# EAGLE design power_dist (EAGLE 9.6.0)
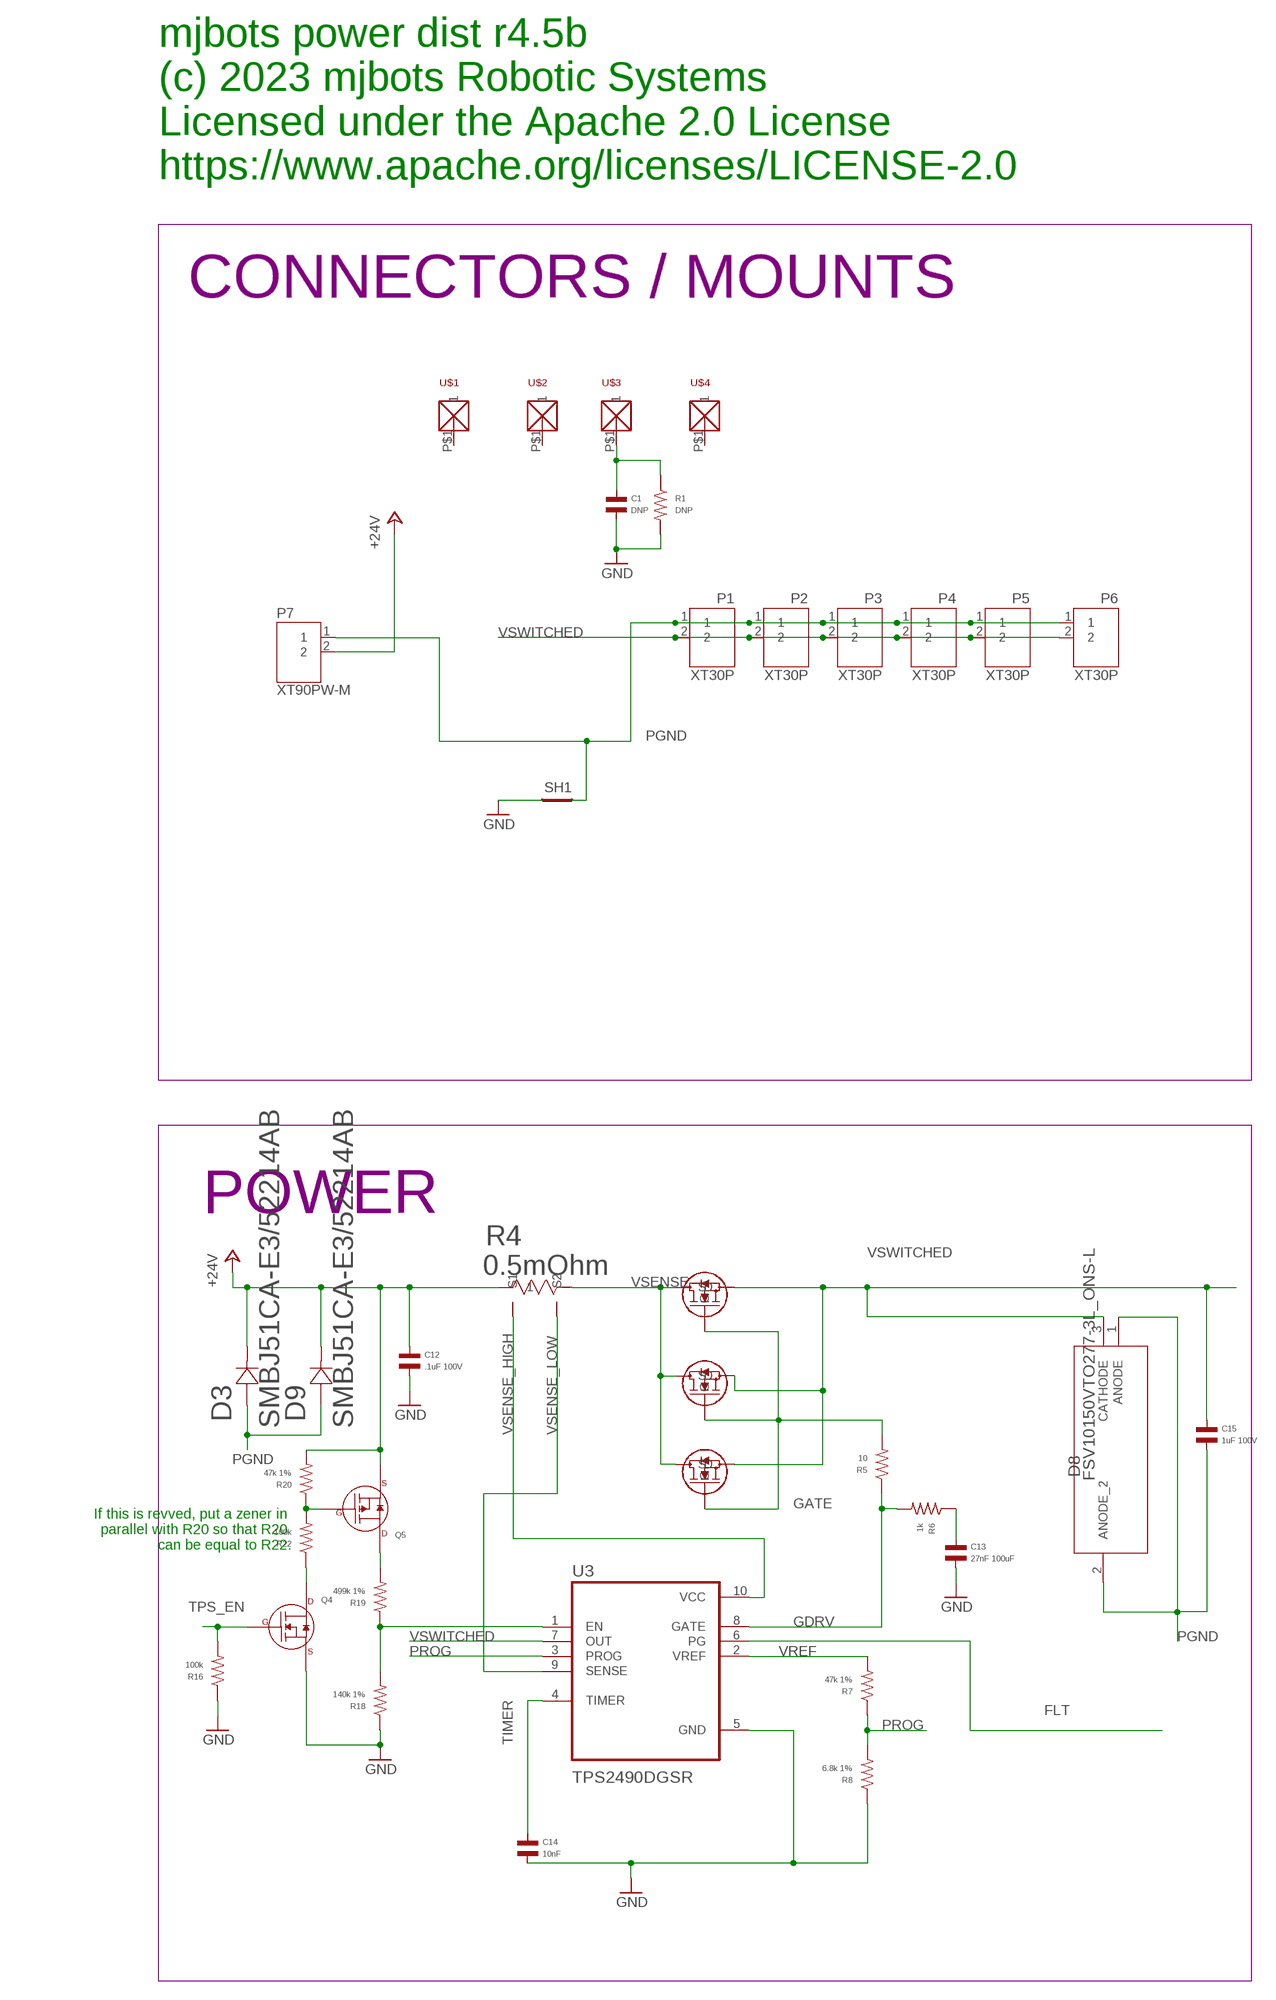
[diagram p0: schematic, sheet 1, part 1 of 2]
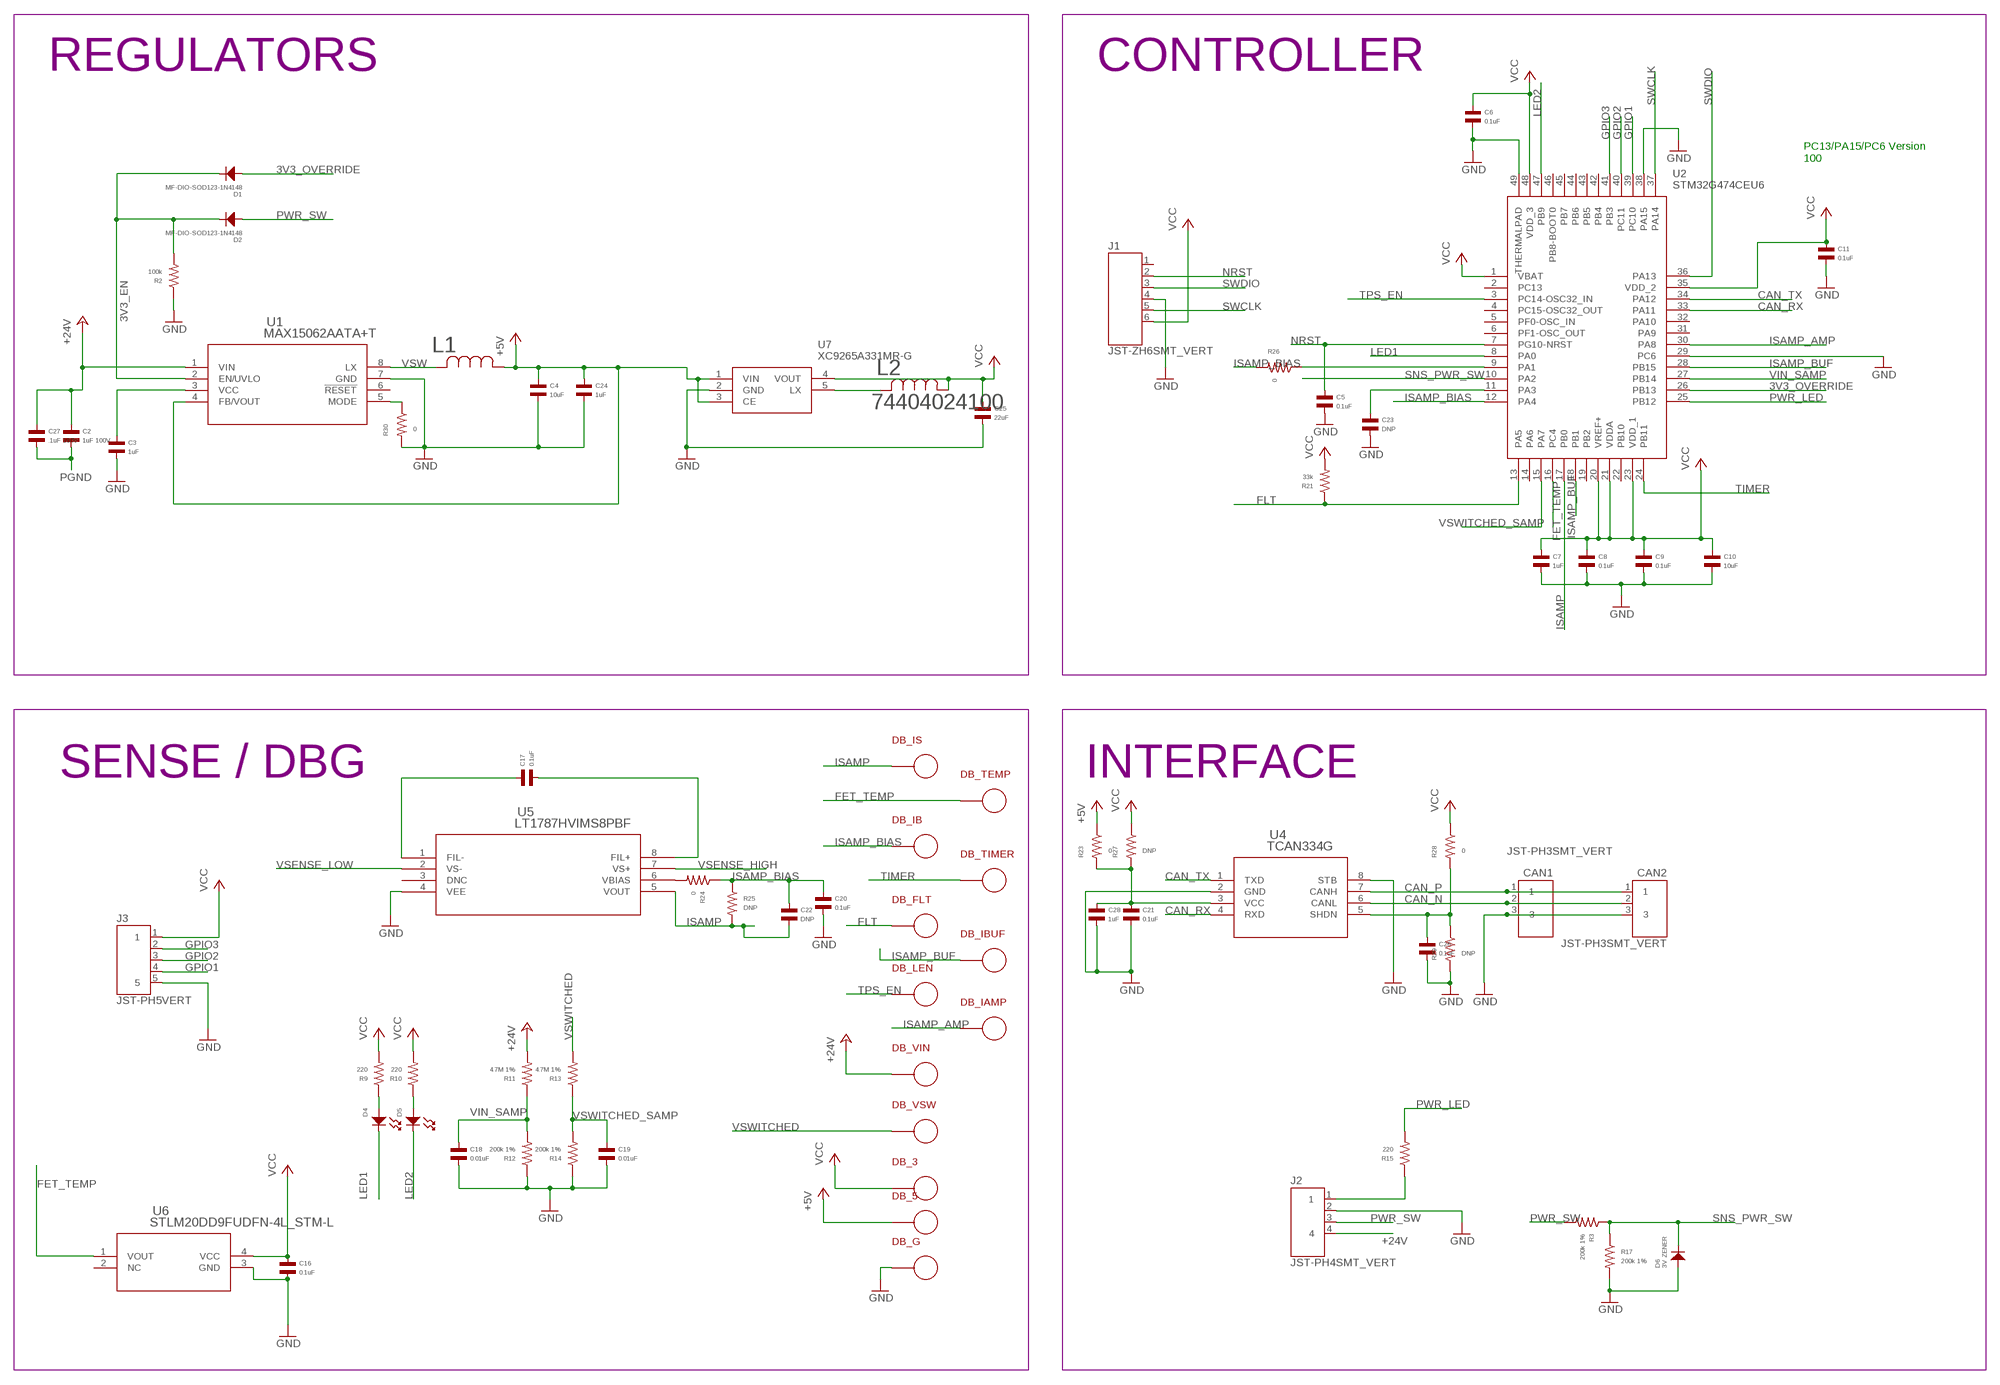
[diagram p1: schematic, sheet 1, part 2 of 2]

## Parts
C1  DNP  CAPACITOR_NP_0603  [C0603]
C2  1uF 100V  CAPACITOR_NP_0805  [C0805]
C3  1uF  CAPACITOR_NP_0603  [C0603]
C4  10uF  CAPACITOR_NP_1206  [C1206]
C5  0.1uF  CAPACITOR_NP_0603  [C0603]
C6  0.1uF  CAPACITOR_NP_0603  [C0603]
C7  1uF  CAPACITOR_NP_0603  [C0603]
C8  0.1uF  CAPACITOR_NP_0603  [C0603]
C9  0.1uF  CAPACITOR_NP_0603  [C0603]
C10  10uF  CAPACITOR_NP_1206  [C1206]
C11  0.1uF  CAPACITOR_NP_0603  [C0603]
C12  .1uF 100V  CAPACITOR_NP_0603  [C0603]
C13  27nF 100uF  CAPACITOR_NP_0603  [C0603]
C14  10nF  CAPACITOR_NP_0603  [C0603]
C15  1uF 100V  CAPACITOR_NP_0805  [C0805]
C16  0.1uF  CAPACITOR_NP_0603  [C0603]
C17  0.1uF  CAPACITOR_NP_0603  [C0603]
C18  0.01uF  CAPACITOR_NP_0603  [C0603]
C19  0.01uF  CAPACITOR_NP_0603  [C0603]
C20  0.1uF  CAPACITOR_NP_0603  [C0603]
C21  0.1uF  CAPACITOR_NP_0603  [C0603]
C22  DNP  CAPACITOR_NP_0603  [C0603]
C23  DNP  CAPACITOR_NP_0603  [C0603]
C24  1uF  CAPACITOR_NP_0402  [C0402]
C25  22uF  CAPACITOR_NP_1206  [C1206]
C26  0.1uF  CAPACITOR_NP_0603  [C0603]
C27  .1uF 100V  CAPACITOR_NP_0603  [C0603]
C28  1uF  CAPACITOR_NP_0603  [C0603]
CAN1  JST-PH3SMT_VERT  [JST_B3B_PH-SM4-TB(LF)(SN)]
CAN2  JST-PH3SMT_VERT  [JST_B3B_PH-SM4-TB(LF)(SN)]
D1  MF-DIO-SOD123-1N4148  DIODES_1N4148_SOD-123  [SOD-123]
D2  MF-DIO-SOD123-1N4148  DIODES_1N4148_SOD-123  [SOD-123]
D3  SMBJ51CA-E3/52214AB  [DIODE_DO-214AB]
D4  LED_SINGLE-0603  [LED0603]
D5  LED_SINGLE-0603  [LED0603]
D6  3V ZENER  DIODES_1N4148_SOD-123  [SOD-123]
D8  FSV10150VTO277-3L_ONS-L  [TO277-3L_ONS-L]
D9  SMBJ51CA-E3/52214AB  [DIODE_DO-214AB]
DB_3  PAD24AWG_PAD  [24AWG_PAD]
DB_5  PAD24AWG_PAD  [24AWG_PAD]
DB_FLT  PAD24AWG_PAD  [24AWG_PAD]
DB_G  PAD24AWG_PAD  [24AWG_PAD]
DB_IAMP  PAD24AWG_PAD  [24AWG_PAD]
DB_IB  PAD24AWG_PAD  [24AWG_PAD]
DB_IBUF  PAD24AWG_PAD  [24AWG_PAD]
DB_IS  PAD24AWG_PAD  [24AWG_PAD]
DB_LEN  PAD24AWG_PAD  [24AWG_PAD]
DB_TEMP  PAD24AWG_PAD  [24AWG_PAD]
DB_TIMER  PAD24AWG_PAD  [24AWG_PAD]
DB_VIN  PAD24AWG_PAD  [24AWG_PAD]
DB_VSW  PAD24AWG_PAD  [24AWG_PAD]
J1  JST-ZH6SMT_VERT  [JST_B6B-ZR-SM4-TF(LF)(SN)]
J2  JST-PH4SMT_VERT  [JST_B4B_PH-SM4-TB(LF)(SN)]
J3  JST-PH5VERT  [JST_B5B_PH-SM4-TB(LF)(SN)]
L1  SRN4018-220M  [IND_BOURNS_SRN4018]
L2  74404024100  [IND_4024100_WRE]
P1  XT30P  [XT30P]
P2  XT30P  [XT30P]
P3  XT30P  [XT30P]
P4  XT30P  [XT30P]
P5  XT30P  [XT30P]
P6  XT30P  [XT30P]
P7  XT90PW-M  [XT90PW-M]
Q1  PSMN4R8-100BSEJ  [D2PAK_SOT404_NEX]
Q2  PSMN4R8-100BSEJ  [D2PAK_SOT404_NEX]
Q3  PSMN4R8-100BSEJ  [D2PAK_SOT404_NEX]
Q4  N-CHANNEL_FET_SOT-23-3  [SOT-23-3]
Q5  P-CHANNEL_FET_SOT-23-3  [SOT-23-3]
R1  DNP  RESISTOR_0603  [R0603]
R2  100k  RESISTOR_0603  [R0603]
R3  200k 1%  RESISTOR_0603  [R0603]
R4  0.5mOhm  SENSE_RESISTOR2512  [SHUNT2512]
R5  10  RESISTOR_0603  [R0603]
R6  1k  RESISTOR_0603  [R0603]
R7  47k 1%  RESISTOR_0603  [R0603]
R8  6.8k 1%  RESISTOR_0603  [R0603]
R9  220  RESISTOR_0603  [R0603]
R10  220  RESISTOR_0603  [R0603]
R11  4.7M 1%  RESISTOR_0603  [R0603]
R12  200k 1%  RESISTOR_0603  [R0603]
R13  4.7M 1%  RESISTOR_0603  [R0603]
R14  200k 1%  RESISTOR_0603  [R0603]
R15  220  RESISTOR_0603  [R0603]
R16  100k  RESISTOR_0603  [R0603]
R17  200k 1%  RESISTOR_0603  [R0603]
R18  140k 1%  RESISTOR_0603  [R0603]
R19  499k 1%  RESISTOR_0603  [R0603]
R20  47k 1%  RESISTOR_0603  [R0603]
R21  33k  RESISTOR_0603  [R0603]
R22  100k  RESISTOR_0603  [R0603]
R23  0  RESISTOR_0603  [R0603]
R24  0  RESISTOR_0603  [R0603]
R25  DNP  RESISTOR_0603  [R0603]
R26  0  RESISTOR_0603  [R0603]
R27  DNP  RESISTOR_0603  [R0603]
R28  0  RESISTOR_0603  [R0603]
R29  DNP  RESISTOR_0603  [R0603]
R30  0  RESISTOR_0603  [R0603]
SH1  SHORTMEDIUM  [SHORT_TOP-MEDIUM]
U1  MAX15062AATA+T  [21-0487A_MXM]
U2  STM32G474CEU6  [QFN50P700X700X60-49N]
U3  TPS2490DGSR  [SOP50P490X110-10N]
U4  TCAN334G  [SOIC8]
U5  LT1787HVIMS8PBF  [MSOP-8_MS]
U6  STLM20DD9FUDFN-4L_STM-L  [UDFN-4L_STM-L]
U7  XC9265A331MR-G  [SOT95P280X130-5N]
U$1  MOUNT  [M2.5MOUNT]
U$2  MOUNT  [M2.5MOUNT]
U$3  MOUNT  [M2.5MOUNT]
U$4  MOUNT  [M2.5MOUNT]

## Nets
3V3_EN: D1.CATHODE D2.CATHODE R2.P$2 U1.2(EN/UVLO)
3V3_OVERRIDE: D1.ANODE U2.26(PB13)
+5V: C4.P$1 C24.P$1 DB_5.P$1 L1.1 R23.P$1 U1.4(FB/VOUT) U7.1(VIN) U7.3(CE)
+24V: C2.P$1 C12.P$1 C27.P$1 D3.P$1 D9.P$1 DB_VIN.P$1 J2.4 P7.2 Q5.P$2(SOURCE) R4.1 R11.P$2 R20.P$2 U1.1(VIN)
CAN_N: CAN1.2 CAN2.2 U4.6(CANL)
CAN_P: CAN1.1 CAN2.1 U4.7(CANH)
CAN_RX: U2.33(PA11) U4.4(RXD)
CAN_TX: U2.34(PA12) U4.1(TXD)
FET_TEMP: DB_TEMP.P$1 U2.16(PC4) U6.1(VOUT)
FLT: DB_FLT.P$1 R21.P$1 U2.13(PA5) U3.6(PG)
GATE: Q1.1(G) Q2.1(G) Q3.1(G) R5.P$2
GDRV: R5.P$1 R6.P$2 U3.8(GATE)
GND: C1.P$2 C3.P$2 C4.P$2 C5.P$2 C6.P$2 C7.P$2 C8.P$2 C9.P$2 C10.P$2 C11.P$2 C12.P$2 C13.P$2 C14.P$2 C16.P$2 C18.P$2 C19.P$2 C20.P$2 C21.P$2 C23.P$2 C24.P$2 C25.P$2 C26.P$2 C28.P$2 CAN1.3 CAN2.3 D6.ANODE DB_G.P$1 J1.4 J2.2 J3.5 Q4.P$2(SOURCE) R1.P$2 R2.P$1 R8.P$1 R12.P$1 R14.P$1 R16.P$1 R17.P$2 R18.P$1 R29.P$2 R30.P$2 SH1.1 U1.7(GND) U2.29(PC6) U2.38(PA15) U2.49(THERMALPAD) U3.5(GND) U4.2(GND) U4.8(STB) U5.4(VEE) U6.3(GND) U7.2(GND)
GPIO1: J3.4 U2.39(PC10)
GPIO2: J3.3 U2.40(PC11)
GPIO3: J3.2 U2.41(PB3)
ISAMP: C22.P$2 DB_IS.P$1 R25.P$2 U2.17(PB0) U5.5(VOUT)
ISAMP_AMP: DB_IAMP.P$1 U2.30(PA8)
ISAMP_BIAS: C20.P$1 C22.P$1 DB_IB.P$1 R24.P$1 R25.P$1 R26.P$2 U2.12(PA4)
ISAMP_BUF: DB_IBUF.P$1 U2.18(PB1) U2.28(PB15)
LED1: D4.CATHODE U2.8(PA0)
LED2: D5.CATHODE U2.47(PB9)
N$1: R30.P$1 U1.5(MODE)
N$2: J2.1 R15.P$1
N$3: R24.P$2 U5.6(VBIAS)
N$4: C3.P$1 U1.3(VCC)
N$5: C23.P$1 U2.11(PA3)
N$6: C17.P$1 U5.1(FIL-)
N$7: C17.P$2 U5.8(FIL+)
N$8: D4.ANODE R9.P$1
N$9: C13.P$1 R6.P$1
N$10: R26.P$1 U2.9(PA1)
N$11: Q5.P$3(DRAIN) R19.P$2
N$12: R18.P$2 R19.P$1 U3.1(EN)
N$13: Q4.P$3(DRAIN) R22.P$1
N$14: D5.ANODE R10.P$1
N$15: C1.P$1 R1.P$1 U$3.P$1
N$16: Q5.P$1(GATE) R20.P$1 R22.P$2
N$17 [power]: C21.P$1 C28.P$1 R23.P$2 R27.P$2 U4.3(VCC)
N$18: L2.2 U7.5(LX)
N$19: C26.P$1 R28.P$2 R29.P$1 U4.5(SHDN)
NRST: C5.P$1 J1.2 U2.7(PG10-NRST)
PGND: C2.P$2 C15.P$2 C27.P$2 D3.P$2 D8.1(ANODE) D8.2(ANODE_2) D9.P$2 P1.1 P2.1 P3.1 P4.1 P5.1 P6.1 P7.1 SH1.2
PROG: R7.P$1 R8.P$2 U3.3(PROG)
PWR_LED: R15.P$2 U2.25(PB12)
PWR_SW: D2.ANODE J2.3 R3.P$2
SNS_PWR_SW: D6.CATHODE R3.P$1 R17.P$1 U2.10(PA2)
SWCLK: J1.5 U2.37(PA14)
SWDIO: J1.3 U2.36(PA13)
TIMER: C14.P$1 DB_TIMER.P$1 U2.24(PB11) U3.4(TIMER)
TPS_EN: DB_LEN.P$1 Q4.P$1(GATE) R16.P$2 U2.3(PC14-OSC32_IN)
VCC [power]: C6.P$1 C7.P$1 C8.P$1 C9.P$1 C10.P$1 C11.P$1 C16.P$1 C25.P$1 DB_3.P$1 J1.6 J3.1 L2.1 R9.P$2 R10.P$2 R21.P$2 R27.P$1 R28.P$1 U2.1(VBAT) U2.20(VREF+) U2.21(VDDA) U2.23(VDD_1) U2.35(VDD_2) U2.48(VDD_3) U6.4(VCC) U7.4(VOUT)
VIN_SAMP: C18.P$1 R11.P$1 R12.P$2 U2.27(PB14)
VREF: R7.P$2 U3.2(VREF)
VSENSE: Q1.2(D) Q2.2(D) Q3.2(D) R4.2
VSENSE_HIGH: R4.3(S1) U3.10(VCC) U5.7(VS+)
VSENSE_LOW: R4.4(S2) U3.9(SENSE) U5.2(VS-)
VSW: L1.2 U1.8(LX)
VSWITCHED: C15.P$1 D8.3(CATHODE) DB_VSW.P$1 P1.2 P2.2 P3.2 P4.2 P5.2 P6.2 Q1.3(S) Q2.3(S) Q3.3(S) R13.P$2 U3.7(OUT)
VSWITCHED_SAMP: C19.P$1 R13.P$1 R14.P$2 U2.15(PA7)
Unconnected: J1.1 U1.6(!RESET) U2.2(PC13) U2.4(PC15-OSC32_OUT) U2.5(PF0-OSC_IN) U2.6(PF1-OSC_OUT) U2.14(PA6) U2.19(PB2) U2.22(PB10) U2.31(PA9) U2.32(PA10) U2.42(PB4) U2.43(PB5) U2.44(PB6) U2.45(PB7) U2.46(PB8-BOOT0) U5.3(DNC) U6.2(NC) U$1.P$1 U$2.P$1 U$4.P$1

## Notes on the sheet
- mjbots power dist r4.5b
  (c) 2023 mjbots Robotic Systems
  Licensed under the Apache 2.0 License
  https://www.apache.org/licenses/LICENSE-2.0
- CONNECTORS / MOUNTS | REGULATORS | CONTROLLER
- PC13/PA15/PC6 Version
  100
- POWER | SENSE / DBG | INTERFACE
- If this is revved, put a zener in 
  parallel with R20 so that R20 
  can be equal to R22.

## Library data of the parts
C1 = mfpassives:CAPACITOR_NP: Library: MF_Passives Description: Device for Non-Polarized Capacitors. Manufacture part number (MPN) can be added via Attributes. Check https://factory.macrofab.com/parts for the house parts list.; POPULATE: 0
C2 C15 = mfpassives:CAPACITOR_NP: Library: MF_Passives Description: Device for Non-Polarized Capacitors. Manufacture part number (MPN) can be added via Attributes. Check https://factory.macrofab.com/parts for the house parts list.; MF: MURATA; MPN: GCM21BC72A105KE36L; POPULATE: 1
C3 C7 C28 = mfpassives:CAPACITOR_NP: Library: MF_Passives Description: Device for Non-Polarized Capacitors. Manufacture part number (MPN) can be added via Attributes. Check https://factory.macrofab.com/parts for the house parts list.; HOUSEPART: 1; MPN: MF-CAP-0603-1uF; POPULATE: 1
C4 C10 = mfpassives:CAPACITOR_NP: Library: MF_Passives Description: Device for Non-Polarized Capacitors. Manufacture part number (MPN) can be added via Attributes. Check https://factory.macrofab.com/parts for the house parts list.; HOUSEPART: 1; MPN: MF-CAP-1206-10uF; POPULATE: 1
C5 C6 C8 C9 C11 C16 C17 C20 C21 C26 = mfpassives:CAPACITOR_NP: Library: MF_Passives Description: Device for Non-Polarized Capacitors. Manufacture part number (MPN) can be added via Attributes. Check https://factory.macrofab.com/parts for the house parts list.; HOUSEPART: 1; MPN: MF-CAP-0603-0.1uF; POPULATE: 1
C12 C27 = mfpassives:CAPACITOR_NP: Library: MF_Passives Description: Device for Non-Polarized Capacitors. Manufacture part number (MPN) can be added via Attributes. Check https://factory.macrofab.com/parts for the house parts list.; HOUSEPART: 0; MPN: GRM188R72A104KA35D; POPULATE: 1
C13 = mfpassives:CAPACITOR_NP: Library: MF_Passives Description: Device for Non-Polarized Capacitors. Manufacture part number (MPN) can be added via Attributes. Check https://factory.macrofab.com/parts for the house parts list.; HOUSEPART: 0; MPN: C0603C273K1RAC7867; POPULATE: 1
C14 C18 C19 = mfpassives:CAPACITOR_NP: Library: MF_Passives Description: Device for Non-Polarized Capacitors. Manufacture part number (MPN) can be added via Attributes. Check https://factory.macrofab.com/parts for the house parts list.; HOUSEPART: 1; MPN: MF-CAP-0603-0.01uF; POPULATE: 1
C22 C23 = mfpassives:CAPACITOR_NP: Library: MF_Passives Description: Device for Non-Polarized Capacitors. Manufacture part number (MPN) can be added via Attributes. Check https://factory.macrofab.com/parts for the house parts list.; HOUSEPART: 1; POPULATE: 0
C24 = mfpassives:CAPACITOR_NP: Library: MF_Passives Description: Device for Non-Polarized Capacitors. Manufacture part number (MPN) can be added via Attributes. Check https://factory.macrofab.com/parts for the house parts list.; HOUSEPART: 1; MPN: MF-CAP-0402-1uF; POPULATE: 1
C25 = mfpassives:CAPACITOR_NP: Library: MF_Passives Description: Device for Non-Polarized Capacitors. Manufacture part number (MPN) can be added via Attributes. Check https://factory.macrofab.com/parts for the house parts list.; MF: Samsung; MPN: CL31B226KPHNNNE; POPULATE: 1
CAN1 CAN2 = precharge:JST-PH3; MF: JST; MPN: B3B-PH-SM4-TB(LF)(SN); POPULATE: 1
D1 D2 = mfdiscretesemi:DIODES: Library: MF_Discrete_Semiconductor Description: Device for Single Packaged Diodes.; HOUSEPART: YES; MPN: MF-DIO-SOD123-1N4148; POPULATE: 1; URL: https://factory.macrofab.com/part/MF-DIO-SOD123-1N4148
D3 D9 = power_dist:SMBJ51CA-E3/52; MPN: SMC5K51A-M3/I; POPULATE: 1
D4 D5 = mfleds:LED_SINGLE: Library: MF_LEDs Description: Device for Single LED Packages. Manufacture part number (MFG#) can be added via Attributes.; HOUSEPART: 1; MPN: MF-LED-0603-RED; POPULATE: 1
D6 = mfdiscretesemi:DIODES: Library: MF_Discrete_Semiconductor Description: Device for Single Packaged Diodes.; MPN: MMSZ4682T1G; POPULATE: 1; VALUE: MF-DIO-SOD123-1N4148
D8 = power_dist:FSV10150V; BUILT_BY: EMA_Jessica; COPYRIGHT: Copyright (C) 2018 Accelerated Designs. All rights reserved; MANUFACTURER_PART_NUMBER: FSV10150V; MPN: FSV10150V; POPULATE: 1; SOURCELIBRARY: ON_Semiconductor_2019-12-30; VENDOR: ON Semiconductor
DB_3 DB_5 DB_FLT DB_G DB_IAMP DB_IB DB_IBUF DB_IS DB_LEN DB_TEMP DB_TIMER DB_VIN DB_VSW = precharge:PAD; POPULATE: 0
J1 = precharge:JST-ZH6; MF: JST; MPN: B6B-ZR-SM4-TF(LF)(SN); POPULATE: 1
J2 = precharge:JST-PH4; MF: JST; MPN: B4B-PH-SM4-TB(LF)(SN); POPULATE: 1
J3 = power_dist:JST-PH5; MF: JST; MPN: B5B-PH-SM4-TB(LF)(SN); POPULATE: 1
L1 = controller:SRN4018-220M; MANUFACTURER_PART_NUMBER: 74404042470; MF: Wurth Electronics; MPN: 74404042470; POPULATE: 1; VENDOR: Wurth
L2 = moteus_hp:74404024100; COPYRIGHT: Copyright (C) 2022 Ultra Librarian. All rights reserved.; DIGI-KEY_PART_NUMBER_1: 732-5428-2-ND; DIGI-KEY_PART_NUMBER_2: 732-5428-1-ND; DIGI-KEY_PART_NUMBER_3: 732-5428-6-ND; MANUFACTURER_PART_NUMBER: 74404024100; MF: Wurth Electronics; MFR_NAME: Wurth Electronics; MPN: 74404024100; POPULATE: 1
P1-P6 = precharge:XT30; MF: AMASS; MPN: XT30UPB-F; POPULATE: 1
P7 = power_dist:XT90; POPULATE: 1
Q1-Q3 = power_dist:PSMN4R8-100BSEJ; BUILT_BY: EMA_Cory; COPYRIGHT: Copyright (C) 2018 Accelerated Designs. All rights reserved; DATASHEET: https://assets.nexperia.com/documents/data-sheet/PSMN4R8-100BSE.pdf; MANUFACTURER_PART_NUMBER: PSMN3R7-100BSE; MPN: PSMN3R7-100BSE; POPULATE: 1; SOURCELIBRARY: Nexperia_2020-02-27; VENDOR: Nexperia
Q4 = mfdiscretesemi:N-CHANNEL_FET: Library: MF_Discrete_Semiconductor Description: Device for Single N-Channel Mosfet. Manufacture part number (MFG#) can be added via Attributes.; HOUSEPART: NO; MPN: BSS123; POPULATE: 1
Q5 = mfdiscretesemi:P-CHANNEL_FET: Library: MF_Discrete_Semiconductor Description: Device for Single P-Channel Mosfet. Manufacture part number (MFG#) can be added via Attributes.; HOUSEPART: NO; MPN: ZXMP10A13FTA; POPULATE: 1
R1 = mfpassives:RESISTOR: Library: MF_Passives Description: Device for Resistors. Manufacture part number (MPN), Voltage, Tolerance, and Wattage Rating can be added via Attributes. Check https://factory.macrofab.com/parts for the house parts list.; POPULATE: 0
R2 R16 R22 = mfpassives:RESISTOR: Library: MF_Passives Description: Device for Resistors. Manufacture part number (MPN), Voltage, Tolerance, and Wattage Rating can be added via Attributes. Check https://factory.macrofab.com/parts for the house parts list.; HOUSEPART: 1; MPN: MF-RES-0603-100K; POPULATE: 1
R3 R12 R14 R17 = mfpassives:RESISTOR: Library: MF_Passives Description: Device for Resistors. Manufacture part number (MPN), Voltage, Tolerance, and Wattage Rating can be added via Attributes. Check https://factory.macrofab.com/parts for the house parts list.; HOUSEPART: 0; MPN: RC0603FR-07200KL; POPULATE: 1
R4 = power_dist:SENSE_RESISTOR; MF: VISHAY DALE; MPN: WSLF2512L5000FEA; POPULATE: 1
R5 = mfpassives:RESISTOR: Library: MF_Passives Description: Device for Resistors. Manufacture part number (MPN), Voltage, Tolerance, and Wattage Rating can be added via Attributes. Check https://factory.macrofab.com/parts for the house parts list.; HOUSEPART: 1; MPN: MF-RES-0603-10; POPULATE: 1
R6 = mfpassives:RESISTOR: Library: MF_Passives Description: Device for Resistors. Manufacture part number (MPN), Voltage, Tolerance, and Wattage Rating can be added via Attributes. Check https://factory.macrofab.com/parts for the house parts list.; HOUSEPART: 1; MPN: MF-RES-0603-1K; POPULATE: 1
R7 R20 = mfpassives:RESISTOR: Library: MF_Passives Description: Device for Resistors. Manufacture part number (MPN), Voltage, Tolerance, and Wattage Rating can be added via Attributes. Check https://factory.macrofab.com/parts for the house parts list.; HOUSEPART: 0; MPN: RC0603FR-0747KL; POPULATE: 1
R8 = mfpassives:RESISTOR: Library: MF_Passives Description: Device for Resistors. Manufacture part number (MPN), Voltage, Tolerance, and Wattage Rating can be added via Attributes. Check https://factory.macrofab.com/parts for the house parts list.; HOUSEPART: 0; MPN: RC0603FR-076K8L; POPULATE: 1
R9 R10 R15 = mfpassives:RESISTOR: Library: MF_Passives Description: Device for Resistors. Manufacture part number (MPN), Voltage, Tolerance, and Wattage Rating can be added via Attributes. Check https://factory.macrofab.com/parts for the house parts list.; HOUSEPART: 1; MPN: MF-RES-0603-220; POPULATE: 1
R11 R13 = mfpassives:RESISTOR: Library: MF_Passives Description: Device for Resistors. Manufacture part number (MPN), Voltage, Tolerance, and Wattage Rating can be added via Attributes. Check https://factory.macrofab.com/parts for the house parts list.; HOUSEPART: 0; MPN: RC0603FR-074M7L; POPULATE: 1
R18 = mfpassives:RESISTOR: Library: MF_Passives Description: Device for Resistors. Manufacture part number (MPN), Voltage, Tolerance, and Wattage Rating can be added via Attributes. Check https://factory.macrofab.com/parts for the house parts list.; HOUSEPART: 0; MPN: RC0603FR-07140KL; POPULATE: 1
R19 = mfpassives:RESISTOR: Library: MF_Passives Description: Device for Resistors. Manufacture part number (MPN), Voltage, Tolerance, and Wattage Rating can be added via Attributes. Check https://factory.macrofab.com/parts for the house parts list.; HOUSEPART: 0; MPN: RC0603FR-07499KL; POPULATE: 1
R21 = mfpassives:RESISTOR: Library: MF_Passives Description: Device for Resistors. Manufacture part number (MPN), Voltage, Tolerance, and Wattage Rating can be added via Attributes. Check https://factory.macrofab.com/parts for the house parts list.; HOUSEPART: 1; MPN: RC0603FR-0733KL; POPULATE: 1
R23 R24 R26 R28 R30 = mfpassives:RESISTOR: Library: MF_Passives Description: Device for Resistors. Manufacture part number (MPN), Voltage, Tolerance, and Wattage Rating can be added via Attributes. Check https://factory.macrofab.com/parts for the house parts list.; HOUSEPART: 1; MPN: MF-RES-0603-0; POPULATE: 1
R25 = mfpassives:RESISTOR: Library: MF_Passives Description: Device for Resistors. Manufacture part number (MPN), Voltage, Tolerance, and Wattage Rating can be added via Attributes. Check https://factory.macrofab.com/parts for the house parts list.; HOUSEPART: 1; POPULATE: 0
R27 R29 = mfpassives:RESISTOR: Library: MF_Passives Description: Device for Resistors. Manufacture part number (MPN), Voltage, Tolerance, and Wattage Rating can be added via Attributes. Check https://factory.macrofab.com/parts for the house parts list.; HOUSEPART: 1; MPN: MF-RES-0603-0; POPULATE: 0
SH1 = shorts:SHORT: Short between two nets; POPULATE: 0
U1 = power_dist:MAX15062AATA+T; BUILT_BY: EMA_Jessica; COPYRIGHT: Copyright (C) 2018 Accelerated Designs. All rights reserved; MANUFACTURER_PART_NUMBER: MAX15062BATA+T; MF: Maxim; MPN: MAX15062BATA+T; POPULATE: 1; REVISION: 1; SOURCELIBRARY: Maxim_DP_2018-06-12; VENDOR: Maxim Integrated Products
U2 = power_dist:STM32G474CEU6: STMICROELECTRONICS - STM32G474CEU6 - MCU, 32BIT, 170MHZ, UFQFPN-48 Source: Datasheet <https://componentsearchengine.com/Datasheets/1/STM32G474CEU6.pdf>; DESCRIPTION: STMICROELECTRONICS - STM32G474CEU6 - MCU, 32BIT, 170MHZ, UFQFPN-48; HEIGHT: 0.6mm; MANUFACTURER_NAME: STMicroelectronics; MANUFACTURER_PART_NUMBER: STM32G474CEU6; MF: ST; MOUSER_PART_NUMBER: 511-STM32G474CEU6; MOUSER_PRICE-STOCK: https://www.mouser.com/Search/Refine.aspx?Keyword=511-STM32G474CEU6; MPN: STM32G474CEU6; POPULATE: 1
U3 = TPS2490DGSR:TPS2490DGSR; DESCRIPTION: 9-V to 80-V hot swap controller with power limiting and latch off 10-VSSOP -40 to 85; DIGI-KEY_PART_NUMBER: 296-26924-1-ND; MF: Texas Instruments; MP: TPS2490DGSR; MPN: TPS2490DGSR; PACKAGE: VSSOP-10 Texas Instruments; POPULATE: 1; PURCHASE-URL: https://pricing.snapeda.com/search/part/TPS2490DGSR/?ref=eda
U4 = precharge:TCAN334G; MF: TI; MPN: TCAN1057AEVDRQ1; POPULATE: 1
U5 = LT1787HVIMS8PBF:LT1787HVIMS8PBF; DESCRIPTION: Current Sense Amplifier 1 Circuit 8-MSOP; DIGI-KEY_PART_NUMBER: LT1787HVIMS8#PBF-ND; MF: Linear Technology; MP: LT1787HVIMS8#PBF; MPN: LT1787HVIMS8; PACKAGE: MSOP-8 Linear Technology; POPULATE: 1; PURCHASE-URL: https://pricing.snapeda.com/search/part/LT1787HVIMS8#PBF/?ref=eda
U6 = power_dist:STLM20DD9F; BUILT_BY: EMA_Jessica; COPYRIGHT: Copyright (C) 2018 Accelerated Designs. All rights reserved; MANUFACTURER_PART_NUMBER: STLM20DD9F; MPN: STLM20DD9F; POPULATE: 1; SOURCELIBRARY: Update_to_database_2020-11-24; VENDOR: STMicroelectronics
U7 = XC9265A331MR-G:XC9265A331MR-G: Switching Voltage Regulators Ultra Low Power PFM DCDC Converter Source: Datasheet <https://www.torexsemi.com/file/xc9265/XC9265.pdf>; DESCRIPTION: Switching Voltage Regulators Ultra Low Power PFM DCDC Converter; HEIGHT: 1.3mm; MANUFACTURER_NAME: Torex; MANUFACTURER_PART_NUMBER: XC9265A331MR-G; MF: Torex; MOUSER_PART_NUMBER: 865-XC9265A331MR-G; MOUSER_PRICE-STOCK: https://www.mouser.co.uk/ProductDetail/Torex-Semiconductor/XC9265A331MR-G?qs=AsjdqWjXhJ9U1u7bKcUHSA%3D%3D; MPN: XC9265A331MR-G; POPULATE: 1
U$1-U$4 = power_dist:MOUNT; POPULATE: 0

## Net classes
1 power: width 0.254 mm

## Board
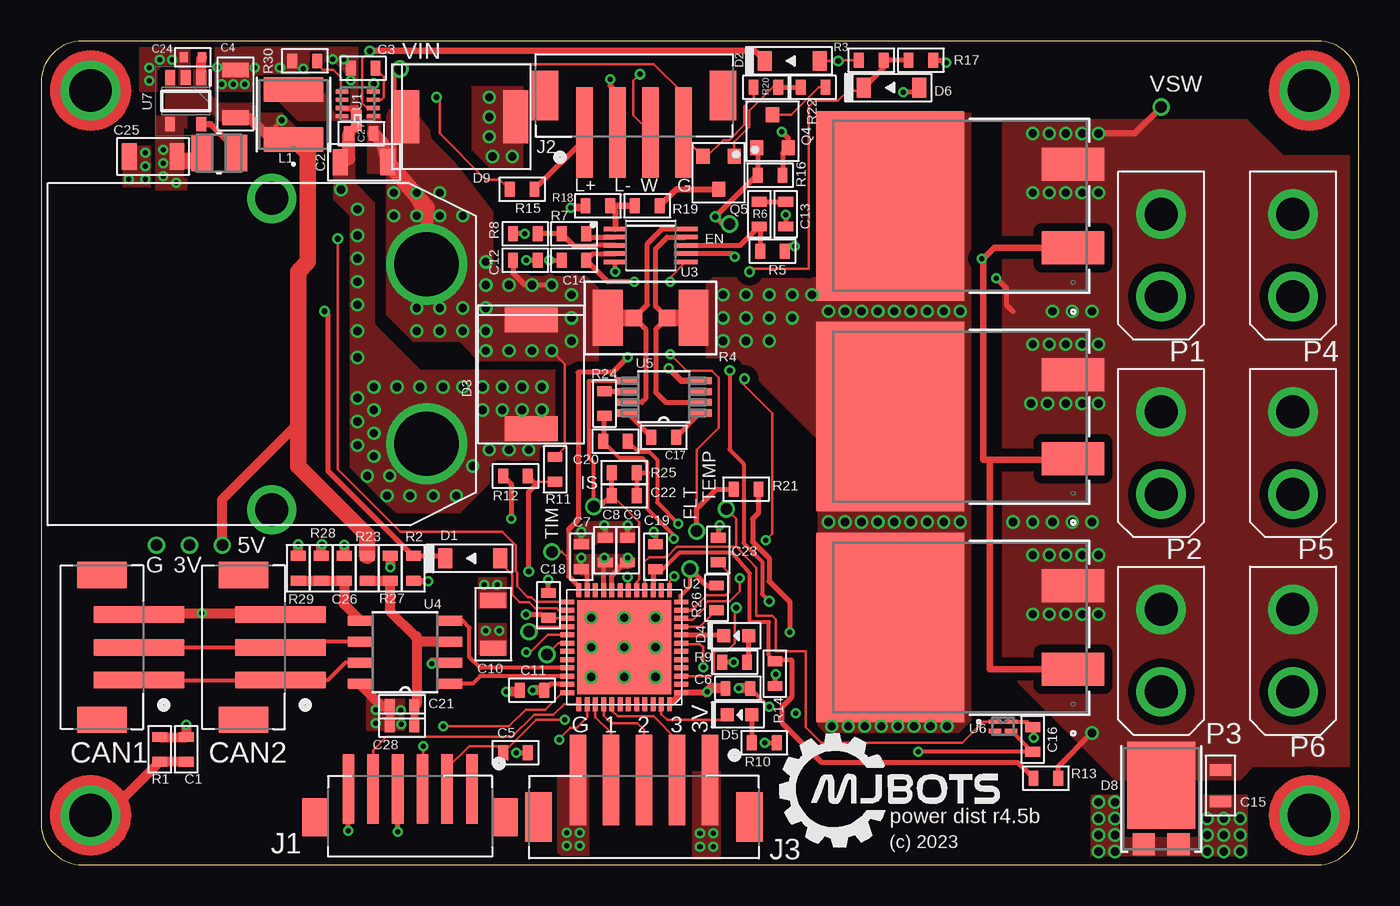
[diagram p2: board, top side]
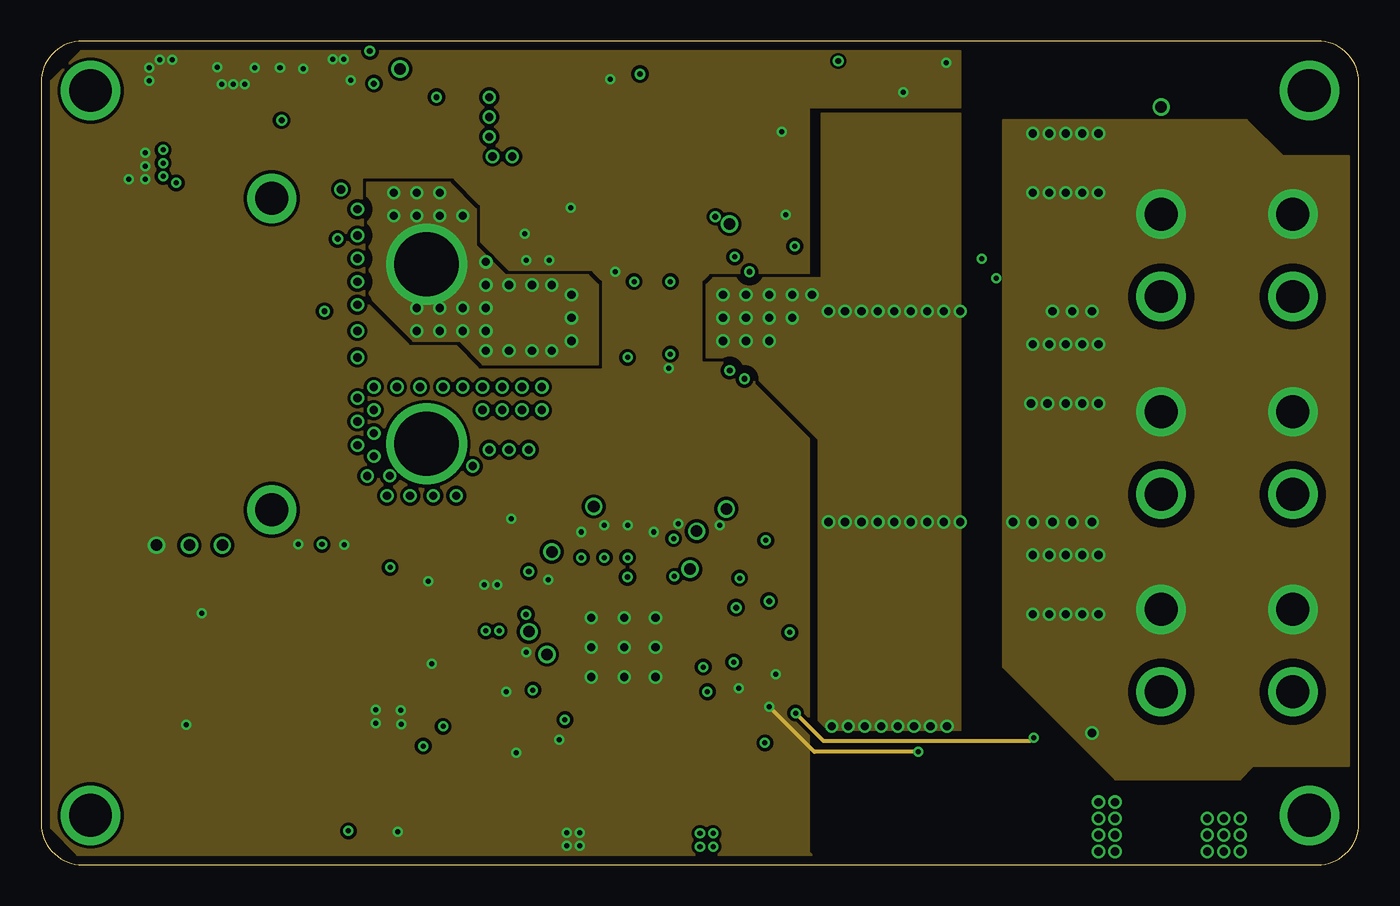
[diagram p3: board, inner layer Route2]
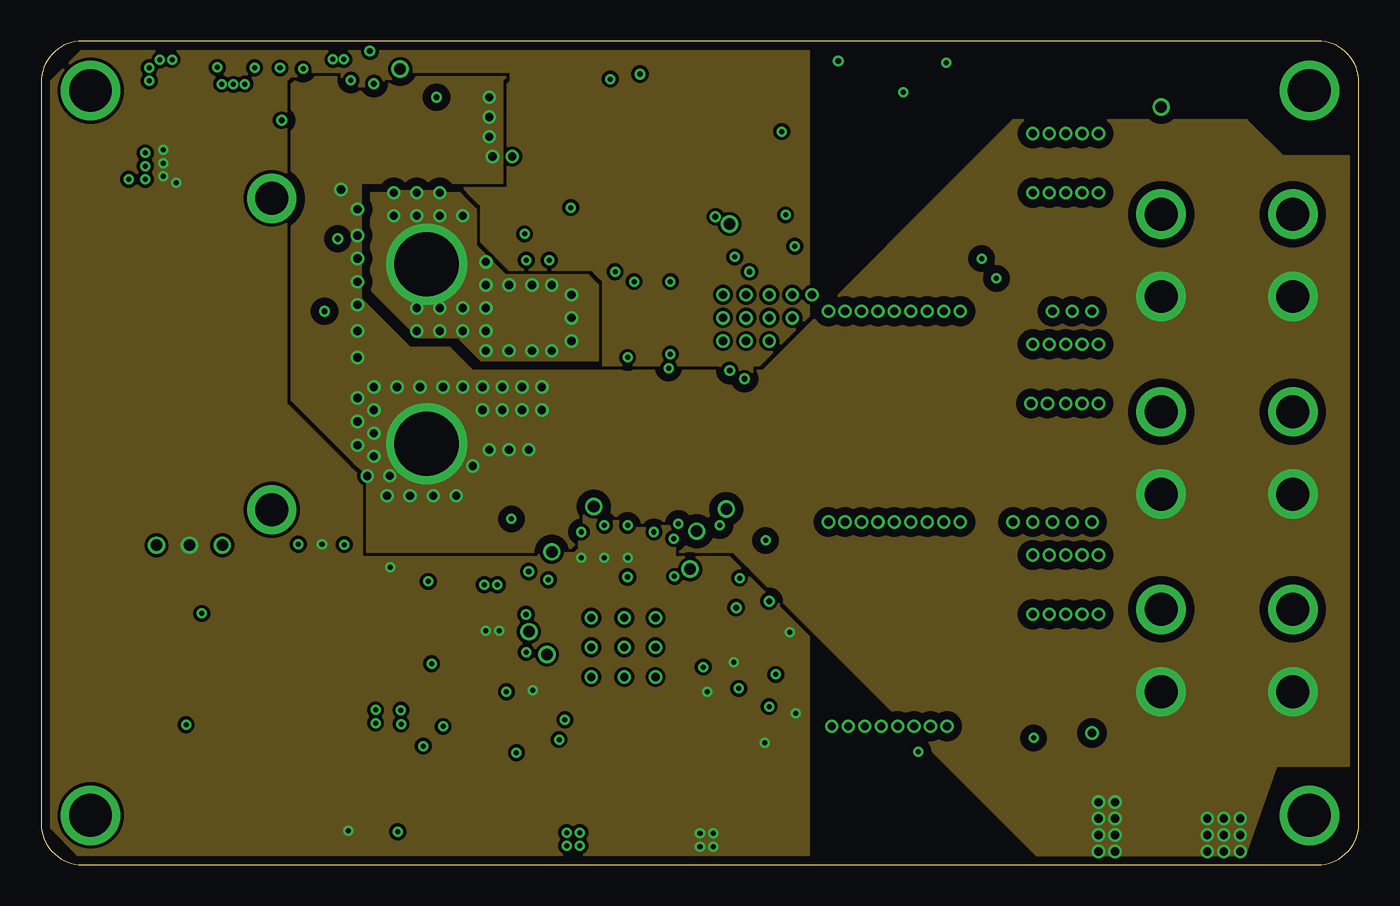
[diagram p4: board, inner layer Route15]
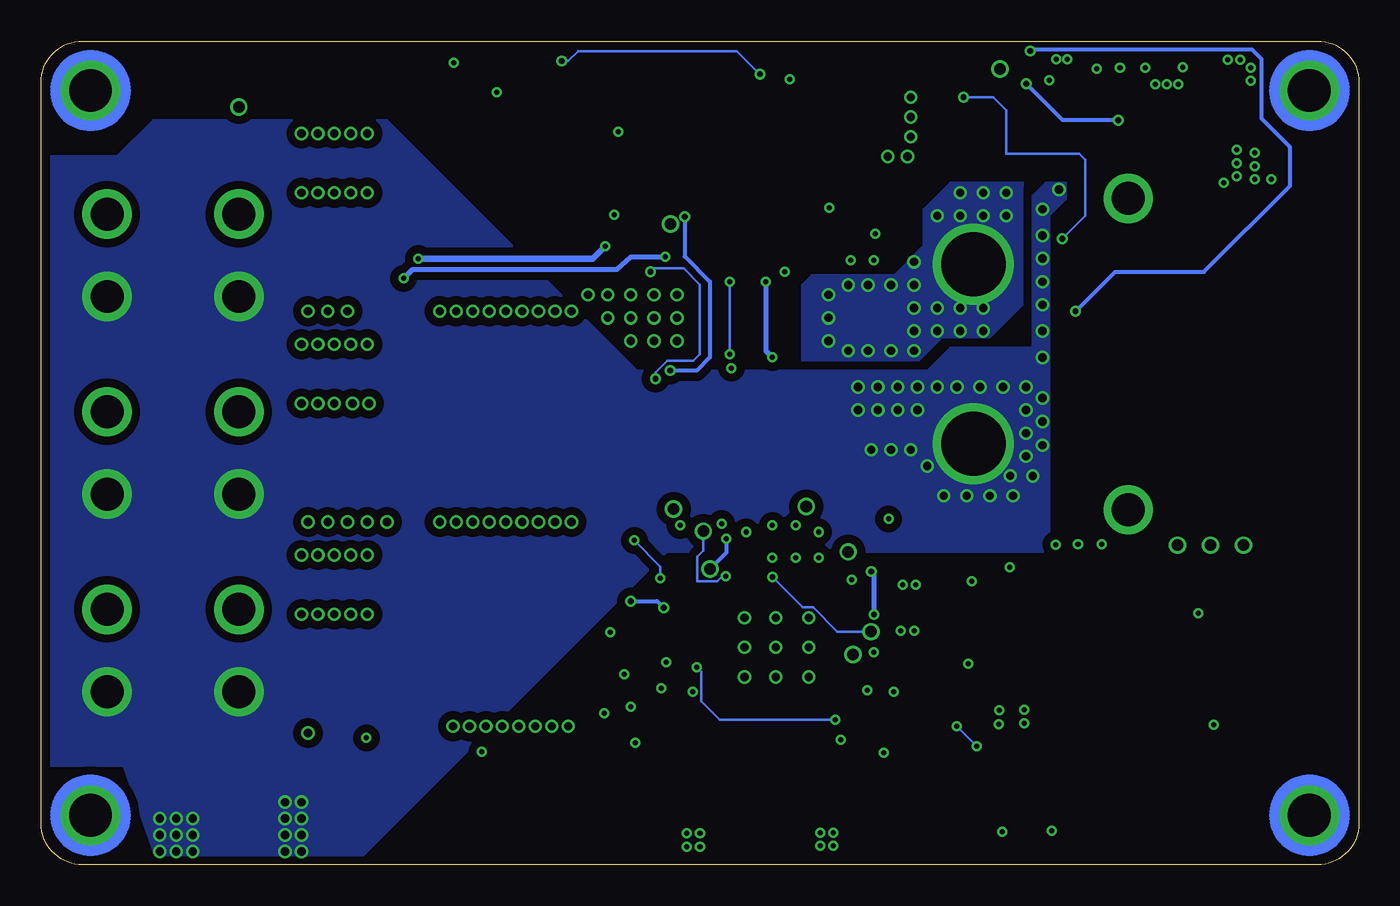
[diagram p5: board, bottom side, seen from below]

Size 80 x 50 mm. Coordinates in mm from the lower left corner, seen from the top.
Outline: 0,47.5 0,2.5 arc90 2.5,0 77.5,0 arc90 80,2.5 80,47.5 arc90 77.5,50 2.5,50 arc90 0,47.5
Copper layers (1*2*15*16): Top 0.035mm / dielectric 0.23mm / Route2 0.035mm / dielectric 0.93mm / Route15 0.035mm / dielectric 0.23mm / Bottom 0.035mm
Design rules "MF_Standard_4_Layer *": minimum track width 6mil, minimum drill 12mil, track to track 6mil, track to pad 6mil, pad to pad 6mil, via to via 6mil, smd to smd 0mil, copper to edge 10mil, drill to drill 10mil, minimum pad ring 6mil, minimum via ring 6mil, stop-mask expansion 2mil, vias tented up to drill 25mil, thermal gap 10mil

### Footprints (pad centres in the part's own frame; a part is rotated, then mirrored left to right if it is on the bottom)
C0603 = smd 0.6 x 0.9: P$1 -0.75,0; P$2 0.75,0
C1206 = smd 0.9 x 1.6: P$1 -1.45,0; P$2 1.45,0
C0805 = smd 0.7 x 1.3: P$1 -0.95,0; P$2 0.95,0
C0402 = smd 0.5 x 0.6: P$1 -0.55,0; P$2 0.55,0
JST_B3B_PH-SM4-TB(LF)(SN) = smd 1 x 5.5: 1 -2,-2.54; 2 0,-2.54; 3 2,-2.54 | smd 1.6 x 3: P1 -4.4,-0.29; P2 4.4,-0.29
SOD-123 = smd 0.85 x 1.2: ANODE 1.675,0; CATHODE -1.675,0
DIODE_DO-214AB = smd 1.52 x 3.2: P$1 -3.305,0; P$2 3.305,0
LED0603 = smd 0.8 x 0.8: ANODE 0.75,0; CATHODE -0.75,0
TO277-3L_ONS-L = smd 1.346 x 1.346: 1 1.05,-2.756; 2 -1.05,-2.756 | smd 4.14 x 5.309: 3 0,0.826
24AWG_PAD = drill 0.7: P$1 0,0
JST_B6B-ZR-SM4-TF(LF)(SN) = smd 0.7 x 4.2: 1 -3.75,-2; 2 -2.25,-2; 3 -0.75,-2; 4 0.75,-2; 5 2.25,-2; 6 3.75,-2 | smd 1.5 x 2.3: P1 -5.8,-0.29; P2 5.8,-0.29
JST_B4B_PH-SM4-TB(LF)(SN) = smd 1 x 5.5: 1 -3,-2.54; 2 -1,-2.54; 3 1,-2.54; 4 3,-2.54 | smd 1.6 x 3: P1 -5.4,-0.29; P2 5.4,-0.29
JST_B5B_PH-SM4-TB(LF)(SN) = smd 1 x 5.5: 1 -4,-2.54; 2 -2,-2.54; 3 0,-2.54; 4 2,-2.54; 5 4,-2.54 | smd 1.6 x 3: P1 -6.4,-0.29; P2 6.4,-0.29
IND_BOURNS_SRN4018 = smd 1.499 x 3.607: 1 -1.524,0; 2 1.524,0
IND_4024100_WRE = smd 1.295 x 2.21: 1 -1.054,0; 2 1.054,0
XT30P = drill 2: 1 -2.5,0; 2 2.5,0
XT90PW-M = drill 3.9: 1 -5.45,0; 2 5.45,0 | drill 2: S1 -9.45,9.4; S2 9.45,9.4
D2PAK_SOT404_NEX = smd 2.007 x 3.81: 1 -2.54,-6.845; 3 2.54,-6.845 | smd 11.506 x 8.992: 2 0,4.255
SOT-23-3 = smd 0.9 x 0.8: P$1 -1,0.95; P$2 -1,-0.95; P$3 1,0
R0603 = smd 0.6 x 0.9: P$1 -0.75,0; P$2 0.75,0
SHUNT2512 = smd 1.8 x 3.4: 1 -2.6,0; 2 2.6,0 | smd 1 x 1: 3 -1,0; 4 1,0
SHORT_TOP-MEDIUM = smd 0.635 x 0.635: 1 0.318,0; 2 -0.318,0
21-0487A_MXM = smd 0.762 x 0.254: 1 -0.953,0.75; 2 -0.953,0.25; 3 -0.953,-0.25; 4 -0.953,-0.75; 5 0.953,-0.75; 6 0.953,-0.25; 7 0.953,0.25; 8 0.953,0.75
QFN50P700X700X60-49N = smd 0.85 x 0.3: 1 -3.45,2.75; 2 -3.45,2.25; 3 -3.45,1.75; 4 -3.45,1.25; 5 -3.45,0.75; 6 -3.45,0.25; 7 -3.45,-0.25; 8 -3.45,-0.75; 9 -3.45,-1.25; 10 -3.45,-1.75; 11 -3.45,-2.25; 12 -3.45,-2.75; 25 3.45,-2.75; 26 3.45,-2.25; 27 3.45,-1.75; 28 3.45,-1.25; 29 3.45,-0.75; 30 3.45,-0.25; 31 3.45,0.25; 32 3.45,0.75; 33 3.45,1.25; 34 3.45,1.75; 35 3.45,2.25; 36 3.45,2.75 | smd 0.3 x 0.85: 13 -2.75,-3.45; 14 -2.25,-3.45; 15 -1.75,-3.45; 16 -1.25,-3.45; 17 -0.75,-3.45; 18 -0.25,-3.45; 19 0.25,-3.45; 20 0.75,-3.45; 21 1.25,-3.45; 22 1.75,-3.45; 23 2.25,-3.45; 24 2.75,-3.45; 37 2.75,3.45; 38 2.25,3.45; 39 1.75,3.45; 40 1.25,3.45; 41 0.75,3.45; 42 0.25,3.45; 43 -0.25,3.45; 44 -0.75,3.45; 45 -1.25,3.45; 46 -1.75,3.45; 47 -2.25,3.45; 48 -2.75,3.45 | smd 5.7 x 5.7: 49 0,0
SOP50P490X110-10N = smd 1.47 x 0.28: 1 -2.15,1; 2 -2.15,0.5; 3 -2.15,0; 4 -2.15,-0.5; 5 -2.15,-1; 6 2.15,-1; 7 2.15,-0.5; 8 2.15,0; 9 2.15,0.5; 10 2.15,1
SOIC8 = smd 1.549 x 0.61: 1 -2.7,1.905; 2 -2.7,0.635; 3 -2.7,-0.635; 4 -2.7,-1.905; 5 2.7,-1.905; 6 2.7,-0.635; 7 2.7,0.635; 8 2.7,1.905
MSOP-8_MS = smd 1.397 x 0.432: 1 -2.21,0.975; 2 -2.21,0.325; 3 -2.21,-0.325; 4 -2.21,-0.975; 5 2.21,-0.975; 6 2.21,-0.325; 7 2.21,0.325; 8 2.21,0.975
UDFN-4L_STM-L = smd 0.762 x 0.254: 1 -0.495,0.279; 2 -0.495,-0.279; 3 0.495,-0.279; 4 0.495,0.279
SOT95P280X130-5N = smd 0.9 x 0.6: 1 -1.4,0.95; 2 -1.4,0; 3 -1.4,-0.95; 4 1.4,-0.95; 5 1.4,0.95
M2.5MOUNT = drill 2.6: P$1 0,0

### Placement (x,y rotation side)
C1  8.8,7 90 top
C2  4.7uF 100V  [C1206]  19.6,42.65 180 top
C3  19.55,48.35 180 top
C4  11.8,46.8 90 top
C5  28.8,6.8 0 top
C6  42.3,10.7 0 top
C7  32.8,18.7 90 top
C8  34.25,19.1 90 top
C9  35.6,19.1 90 top
C10  27.45,14.6 90 top
C11  29.8,10.6 180 top
C12  29.4,36.7 0 top
C13  45.2,39.5 270 top
C14  32.35,36.7 180 top
C15  71.6,4.8 270 top
C16  60.2,7.6 270 top
C17  37.8,25.95 180 top
C18  30.8,15.75 90 top
C19  37.3,18.7 90 top
C20  34.87,25.71 0 top
C21  21.91,9.6 180 top
C22  35.4,22.4 180 top
C23  41.11,19.11 90 top
C24  9.21,49.02 180 top
C25  6.8,43 180 top
C26  18.4,18 90 top
C27  19.43,44.39 180 top
C28  21.91,8.48 180 top
CAN1  3.4,13.2 90 top
CAN2  12,13.2 90 top
D1  26.2,18.6 0 top
D2  45.6,48.8 0 top
D3  29.75,29.77 270 top
D4  42.2,13.9 0 top
D5  42.4,9.1 0 top
D6  51.63,47.18 0 top
D8  68,4 0 top
D9  25.5,45.41 0 top
DB_3  9,19.4 0 top
DB_5  11,19.4 0 top
DB_FLT  39.8,20.25 0 top
DB_G  7,19.4 0 top
DB_IAMP  30.71,12.76 0 top
DB_IB  39.4,17.95 0 top
DB_IBUF  29.61,14.15 0 top
DB_IS  33.55,21.75 0 top
DB_LEN  41.79,38.9 0 top
DB_TEMP  41.6,21.6 90 top
DB_TIMER  31,19 0 top
DB_VIN  21.79,48.31 0 top
DB_VSW  68,46 0 top
J1  22.4,2.6 180 top
J2  36,47 0 top
J3  36.6,2.6 180 top
L1  15.32,45.55 90 top
L2  10.8,43.2 0 top
P1  68,37 90 top
P2  68,25 90 top
P3  68,13 90 top
P4  76,37 90 top
P5  76,25 90 top
P6  76,13 90 top
P7  23.4,31 90 top
Q1  55.8,27.2 90 top
Q2  55.8,14.4 90 top
Q3  55.8,40 90 top
Q4  44.4,44.53 90 top
Q5  41.13,42.01 270 top
R1  7.2,7 90 top
R2  22.6,18 90 top
R3  50.4,48.85 180 top
R4  37,33.2 0 top
R5  44.4,37.25 0 top
R6  43.6,39.5 270 top
R7  32.35,38.3 0 top
R8  29.4,38.3 0 top
R9  42.1,12.3 180 top
R10  43.9,7.4 0 top
R11  31.2,24 90 top
R12  28.8,23.6 0 top
R13  61,5.25 0 top
R14  44.55,11.6 90 top
R15  29.2,41 180 top
R16  44.26,41.86 180 top
R17  53.41,48.85 0 top
R18  33.8,40 0 top
R19  36.8,40 0 top
R20  44,47.2 180 top
R21  42.8,22.8 0 top
R22  46.87,47.2 180 top
R23  19.8,18 270 top
R24  34.2,28 90 top
R25  35.4,23.8 180 top
R26  41,16.2 90 top
R27  21.2,18 270 top
R28  17,18 270 top
R29  15.6,18 90 top
R30  16,48.8 180 top
SH1  19.14,45.2 90 top
U1  19.21,46.19 180 top
U2  35.4,13.2 180 top
U3  37,37.6 0 top
U4  22.1,12.9 180 top
U5  37.8,28.4 180 top
U6  58.4,8.4 0 top
U7  8.77,46.37 270 top
U$1  77,47 0 top
U$2  3,47 0 top
U$3  3,3 0 top
U$4  77,3 0 top

### Tracks (layer width: path | path; a pad name or v marks a point on that pad's centre or on a via)
3V3_EN  (via drill 0.35)
  Top 0.152: U1.2 20.12,45.89 19.84,45.89 19.49,46.24 19.49,48.94 v19.96,49.41
  Top 0.305: v17.2,33.6 17.4,33.4 17.4,23.93 22.57,18.75 R2.P$2 24.38,18.75 D1.CATHODE
  Top 0.406: D2.CATHODE 43.31,49.41 v19.96,49.41
  Bottom 0.254: v17.2,33.6 14.8,36 9.4,36 4.2,41.2 4.2,43.59 5.92,45.31 5.92,48.93 6.49,49.5 19.85,49.5 19.86,49.51 v19.96,49.41
3V3_OVERRIDE
  Top 0.152: U2.26 31.42,15.45 31.3,15.57 30,15.57 29.63,15.94 29.06,15.94 28.6,16.4 28.6,17.6 27.88,18.32 D1.ANODE
+5V  (via drill 0.35)
  Top 0.152: L1.1 14.97,44.03 14.2,44.8 | 20.2,46.98 U1.4
  Top 0.254: 14.2,44.8 v14.6,45.2 | v20.2,47.42 20.2,46.98
  Top 0.6: DB_5.P$1 11,22.2 15.6,26.8
  Top 0.61: 15.37,44.03 L1.1 13.97,44.03 12.66,45.34 | U7.1 9.72,48.98 C24.P$1
  Top 1: R23.P$1 19.8,20 15.6,24.2 15.6,26.8 15.6,36 16.2,36.6 16.2,43.2 15.37,44.03
  Bottom 0.254: v14.6,45.2 17.98,45.2 v20.2,47.42
  pour Top (rank 2, no thermals): 7.6,48.2 10,48.2 10,47 10.8,46.2 12.8,46.2 13.6,45.2 10.8,45.2 10.2,45.8 7.6,45.8
  pour Top (no thermals): 11.4,46.2 12.6,46.2 13.2,45.6 14.6,45.6 15.8,44.4 13.2,44.4 12.6,45 11.4,45
+24V  (via drill 0.5)
  Top 0.152: v31,31.2 31.8,30.4 31.8,25.35 R11.P$2 | DB_VIN.P$1 22.08,48.6 37.2,48.6 39,46.8 J2.4 39,44.19 Q5.P$2 40.41,43.01 41.4,44 41.77,44 42.69,44.92 42.69,46.04 43.25,46.6 R20.P$2
  Top 0.254: DB_VIN.P$1 21.45,47.97 21.45,42.51 23.4,38.76 23.4,37 P7.2
  Top 0.305: C12.P$1 28.65,35.9 29.35,35.2 v31,35.2
  Top 0.8: 23.4,39.87 23.4,37 | C2.P$1 20.73,43.84 C27.P$1
  Top 1: C2.P$1 23.4,39.87
  other vias: 32.2,34.6 29.8,35.2 32.2,33.2 29.8,31.2 32.2,31.8 28.4,31.2 27,31.2 27,32.4 25.6,32.4 24.2,32.4 22.8,32.4 25.6,33.8 27,33.8 27,35.2 28.4,35.2 27,36.6 25.6,39.4 24.2,40.8 24.2,39.4 22.8,39.4 21.4,39.4 21.4,40.8 22.8,40.8 24.2,33.8 22.8,33.8
  pour Top (isolate 0.5, rank 2, no thermals): 21,45.8 22.6,45.8 27.4,39.6 27.4,36.6 28.2,35.8 33.2,35.8 33.8,35.2 33.8,30.4 26.8,30.4 25.4,31.8 22.6,31.8 21,33.4
  pour Route2 (isolate 0.5, rank 2, no thermals): 19.8,41.4 24.8,41.4 26.4,39.8 26.4,37.6 28.2,35.8 33.2,35.8 33.8,35.2 33.8,30.4 26.8,30.4 25.4,31.8 22.6,31.8 19.8,34.6
  pour Route15 (isolate 0.5, rank 2, no thermals): 19.8,41.4 24.8,41.4 26.4,39.8 26.4,37.6 28.2,35.8 33.2,35.8 33.8,35.2 33.8,30.4 26.8,30.4 25.4,31.8 22.6,31.8 19.8,34.6
  pour Bottom (isolate 0.5, rank 2, no thermals): 20.4,41.4 24.8,41.4 26.4,39.8 26.4,37.6 28.2,35.8 33.2,35.8 33.8,35.2 33.8,30.4 26.8,30.4 25.4,31.8 22.6,31.8 20.4,34
  pour Top (no thermals): 19.85,45.53 20.6,45.53 20.6,42 19.85,42
CAN_N
  Top 0.254: CAN1.2 14.2,13.2 CAN2.2 15.8,13.2 16.14,13.54 U4.6
CAN_P
  Top 0.254: CAN1.1 CAN2.1 17.4,11.2 18.46,12.27 U4.7
CAN_RX
  Top 0.254: U2.33 26.65,11.95 26,12.6 26,14.4 25.59,14.8 U4.4
CAN_TX
  Top 0.254: U4.1 26.2,10.99 26.66,11.45 U2.34
FET_TEMP
  Top 0.152: U6.1 57.2,8.68 55.94,7.42 47.35,7.42 46.42,8.35 46.42,12.95 44.6,12.95 44.6,14.89 44.39,15.1 43.41,15.1 43.41,18.03 42.49,19.02 42.2,19.31 | 42.2,19.31 38.6,19.31 37.98,18.68 36.91,18.68 36.62,18.39 36.62,17.45 36.65,17.43 U2.16 | DB_TEMP.P$1 42.2,21 42.2,19.31
FLT  (via drill 0.3)
  Top 0.152: U3.6 38.2,35.65 v38.2,35.4 | v38.2,31 39.2,30 40.7,30 41.13,29.57 41.13,26.53 39.8,25.2 DB_FLT.P$1 | U2.13 38.15,17.2 v38.45,17.5
  Top 0.305: DB_FLT.P$1 39.8,21.6 41,22.8 R21.P$1
  Bottom 0.152: v38.2,35.4 v38.2,31 | v38.45,17.5 38.63,17.5 38.94,17.2 40.15,17.2 40.15,18.7 39.8,19.05 DB_FLT.P$1
GATE  (via drill 0.3)
  Top 0.406: Q3.1 57.86,37.46 57.2,36.8 | 57.2,36.8 57.2,24.6 57.6,24.6 | 57.6,24.6 62.59,24.6 Q1.1 | Q2.1 57.6,11.86 57.6,24.6 | 57.2,36.8 v57.1,36.8 | v45.75,37.55 45.45,37.55 R5.P$2
  Bottom 0.406: v57.1,36.8 46.5,36.8 v45.75,37.55
GDRV
  Top 0.305: R5.P$1 43.65,38.7 R6.P$2 42.45,37.6 U3.8
GND  (via drill 0.3, 0.5)
  Top 0.152: 19.15,45.73 19.17,45.71 19.17,45.93 19.15,45.95 19.15,45.94 19.15,45.73 | SH1.1 19.15,45.43 19.15,45.73 | U2.29 30.75,13.95 29.7,12.9 v29.45,12.9 | U2.38 33.15,8.95 32.51,8.31 32.11,8.31 31.45,7.65 v31.45,7.6
  Top 0.254: J3.5 32.67,5.07 | U6.3 60.17,6.85 C16.P$2 v53.25,6.85 | v44.2,9.6 44.15,9.6 C6.P$2 | C20.P$2 36.24,25.09 36.91,25.09 37.4,24.6 37.4,22 v38.69,20.71
  Top 0.305: C7.P$2 v32.8,20.2 | C9.P$2 v35.6,20.6 | v34.2,20.6 34.25,20.55 C8.P$2 | R12.P$1 28.55,23.1 v28.55,21 | C19.P$2 37.3,20.1 v37.2,20.2 | C11.P$2 28.95,10.5 | v21.65,2 J1.4 | 32.7,5.04 32.67,5.07 | R14.P$1 44.55,11.5 v44.6,11.55 | C18.P$2 v30.8,17.3 | v29.45,36.7 C12.P$2 | v29.35,38.3 R8.P$1 | v30.85,36.7 C14.P$2 | v34.85,36 U3.5 | v45.2,39.45 C13.P$2 | v28.85,6.8 C5.P$2 | C23.P$2 41.11,20.52 v41.2,20.61 | v34.55,47.7 34.55,47.3 35,46.85 J2.2 | R18.P$1 32.95,39.9 | v44.96,44.51 45.35,44.12 Q4.P$2 45.01,43.19 R16.P$1 | D6.ANODE 53.02,46.9 v52.35,46.9 | R17.P$2 54.8,48.85 v54.95,48.7 | CAN1.3 6,15.26 | 14.48,15.26 CAN2.3
  Top 0.35: U1.7 19.15,45.94
  Top 0.406: U5.4 38.88,29.38 v38.1,30.15 | v23.5,17.2 22.65,17.2 R2.P$1
  Top 0.5: 32.95,39.9 v32.15,39.9 | C21.P$2 C28.P$2
  Top 0.6: v8.8,8.5 C1.P$2 R1.P$2 | 6,15.26 v9.75,15.26 14.48,15.26
  Top 0.61: C21.P$2 20.7,9.6 19.4,10.9 U4.8 | 28.95,10.5 v28.25,10.5 | C6.P$2 v42.35,10.7 | R29.P$2 v15.61,19.46 | v18.4,19.43 C26.P$2 | U4.2 23.77,12.27 v23.7,12.2
  Route2 0.254: v53.25,6.85 46.95,6.85 v44.2,9.6
  other vias: 33.4,15 35.4,15 37.3,15 35.4,13.2 37.3,13.2 37.3,11.4 35.4,11.4 33.4,11.4 26.9,17 27.7,17 32.7,1.95 33.4,13.2 12.37,47.39 6.32,43.22 6.32,42.42 17.71,48.89 18.37,48.89 18.8,47.63 14.5,48.38 15.9,48.32 11.67,47.38 6.32,41.62 5.32,41.62 12.96,48.39 10.69,48.41 10.96,47.39 7.95,48.88 7.21,48.87 6.56,48.39 6.56,47.59 20.3,9.4 20.3,8.6 21.84,9.39 21.85,8.54 31.9,1.95 31.9,1.15 32.7,1.15
  pour Top (no thermals): 26.6,17.4 28.2,17.4 28.2,15.6 26.6,15.6
  pour Route2 (isolate 0.2, rank 3, no thermals): 0.6,47.6 2.4,49.4 46.6,49.4 46.6,0.8 46.8,0.6 2.2,0.6 0.6,2.2
  pour Route2 (no thermals): 44.4,49.4 55.8,49.4 55.8,46 45,46 45,48.8
  pour Top (no thermals): 5,43.6 6.6,43.6 6.6,41.2 5,41.2
  pour Top (no thermals): 17.8,49.61 19.2,49.61 19.2,46 19.4,45.8 19.4,45.2 18.82,45.2 18.82,47.78 17.8,48.8
  pour Top (no thermals): 12.2,49.61 16.2,49.61 16.2,48 12.2,48
  pour Top (no thermals): 32.4,20.2 33,20.8 35.6,20.8 36,20.4 36,19.6 33.8,19.6 33.4,19.2 32.4,19.2
  pour Top (no thermals): 10.6,49.56 13,49.56 13,48.2 12.8,48 12.8,47 10.6,47
  pour Top (no thermals): 6,49.57 9,49.57 9,47.4 8.4,47.4 8.4,48.4 8.2,48.6 7.4,48.6 7,48.2 7,47 6,47
  pour Top (no thermals): 19.8,10 22,10 22,8.2 19.8,8.2
  pour Top (no thermals): 15.8,49.61 19.2,49.61 19.2,48.8 15.8,48.8
  pour Top (no thermals): 31.4,5.4 33.2,5.4 33.2,0.6 31.6,0.6 31.4,0.8
GPIO1
  Top 0.152: U2.39 33.65,8.95 34.6,8 J3.4
GPIO2
  Top 0.152: U2.40 34.15,9.05 34.6,8.6 36.2,8.6 36.6,8.2 J3.3
GPIO3
  Top 0.152: J3.2 38.5,5.25 38.6,5.35 38.6,7.6 37.2,9 35,9 34.65,9.35 U2.41
ISAMP
  Top 0.152: U2.17 36.15,17.15 36.32,17.32 36.32,17.33 36.32,20.8 34.72,22.4 C22.P$2
  Top 0.254: DB_IS.P$1 33.55,24.4 33.26,24.69 33.26,29.38 U5.5
  Top 0.305: DB_IS.P$1 33.95,21.75 34.6,22.4 C22.P$2 R25.P$2
ISAMP_AMP
  Top 0.152: U2.30 31.4,13.45 DB_IAMP.P$1
ISAMP_BIAS  (via drill 0.3)
  Top 0.254: v38.4,19.8 38.4,20 36.8,21.6 36.8,23.8 36.8,24.4 36.53,24.67 35.13,24.67 34.12,25.68 C20.P$1 | U2.12 38.8,16 38.8,16.3 39.4,16.9 DB_IB.P$1
  Top 0.305: C20.P$1 34.2,25.79 R24.P$1 | C22.P$1 R25.P$1 36.8,23.8 | DB_IB.P$1 40.4,16.95 R26.P$2
  Bottom 0.254: v38.4,19.8 38.4,18.95 DB_IB.P$1
ISAMP_BUF  (via drill 0.35)
  Top 0.152: U2.18 35.65,17.43 v35.6,17.47 | U2.28 29.91,14.45 DB_IBUF.P$1
  Bottom 0.152: v35.6,17.47 33.76,15.63 33.14,15.63 31.66,14.15 DB_IBUF.P$1
LED1
  Top 0.305: U2.8 41.4,13.95 D4.CATHODE
LED2
  Top 0.152: U2.47 37.65,9.15 38,8.8 41.35,8.8 D5.CATHODE
N$1
  Top 0.152: U1.5 18.2,47 18.2,47.81 17.75,48.26 17.09,48.26 16.75,48.6 R30.P$1
N$2
  Top 0.305: J2.1 33,44.05 R15.P$1
N$3
  Top 0.305: R24.P$2 35.56,28.75 U5.6
N$4
  Top 0.152: U1.3 20.64,46.44 20.8,46.6 20.8,47.85 C3.P$1
N$5
  Top 0.152: 39.73,15.68 40.02,15.97 40.41,16.36 41.58,16.36 41.78,16.56 41.78,17.69 C23.P$1
  Top 0.203: U2.11 39.5,15.45 39.73,15.68
N$6
  Top 0.305: C17.P$1 38.55,25.96 U5.1
N$7
  Top 0.305: U5.8 37.05,25.96 C17.P$2
N$8
  Top 0.305: R9.P$1 42.95,12.4 D4.ANODE
N$9
  Top 0.305: R6.P$1 C13.P$1
N$10
  Top 0.152: U2.9 40,14.45 R26.P$1
N$11
  Top 0.35: R19.P$2 38.56,41.01 Q5.P$3
N$12
  Top 0.152: R18.P$2 34.85,39.7
  Top 0.35: 34.85,39.7 U3.1
  Top 0.4: R19.P$1 R18.P$2
N$13
  Top 0.152: R22.P$1 47.21,47.2 45.54,45.53 Q4.P$3
N$14
  Top 0.305: D5.ANODE R10.P$1
N$15
  Top 0.254: 3.95,3 U$3.P$1
  Top 0.6: C1.P$1 R1.P$1 3.95,3
N$16
  Top 0.152: Q5.P$1 42.08,43.88 43,44.8 43,45.79 44.41,47.2 R20.P$1
  Top 0.305: R20.P$1 R22.P$2
N$17
  Top 0.5: C21.P$1 C28.P$1
  Top 0.61: R23.P$2 R27.P$2 21.2,15.37 22.73,13.84 | C21.P$1 22.8,9.74 22.8,13.9 22.73,13.84 | U4.3 24.79,13.53 23.05,13.53 22.73,13.84
N$18
  Top 0.3: L2.2 11.85,43.4
  Top 0.4: 11.85,43.4 10.28,44.97 U7.5
N$19
  Top 0.61: R29.P$1 R28.P$2 C26.P$1 18.4,15.8 U4.5
NRST  (via drill 0.3)
  Top 0.152: J1.2 24.6,4.55 24.6,5.82 25.98,7.2 27.65,7.2 C5.P$1 30.05,8.8 v31.8,8.8 | U2.7 38.9,13.4 40,13.4 40.2,13.2 v40.2,12
  Bottom 0.152: v40.2,12 39.92,11.72 39.92,9.92 38.8,8.8 v31.8,8.8
PGND  (via drill 0.5)
  Top 0.152: SH1.2
  Top 0.5: 19.15,44.86 SH1.2
  Top 0.61: C27.P$2 19.15,44.86
  Top 0.8: C2.P$2 18.68,42.89 C27.P$2
  other vias: 65.2,1.8 65.2,0.8 65.2,2.8 70.8,1.8 70.8,0.8 71.8,0.8 71.8,1.8 29.6,25.2 28.4,25.2 27.2,25.2 26.8,27.6 26.8,29 27.2,46.6 27.2,45.4 27.2,44.2 27.4,43 28.6,43 25.6,29 24.4,29 23,29 28,29 29.2,29 30.4,29 28,27.6 29.2,27.6 30.4,27.6 21.6,29 20.2,29 20.2,27.6 20.2,26.2 20.2,24.8 21.17,23.62 22.4,22.4 23.8,22.4 25.2,22.4 26.2,24.2 19.21,28.33 19.2,26.91 19.21,25.46 19.8,23.6 21,22.4 64.2,2.8 64.2,1.8 64.2,0.8 72.8,1.8 72.8,0.8 70.8,2.8 71.8,2.8 72.8,2.8 64.2,3.8 65.2,3.8 19.2,30.8 19.2,32.4 19.2,34 19.2,35.4 19.2,36.8 19.2,38.2 19.2,39.8 18.2,41
  pour Top (isolate 0.5, no thermals): 63.8,4.2 73.2,4.2 73.2,0.4 63.8,0.4
  pour Top (isolate 0.5, no thermals): 18.8,30 31.36,30 31.4,26.2 30.4,25.2 30.4,24.6 28.6,24.6 25.4,21.4 21.6,21.4 18.8,23.92
  pour Route15 (isolate 0.5, no thermals): 19.8,31.4 24.8,31.4 26.2,30 43.8,30 59,45.2 73.2,45.2 75.4,43 79.4,43 79.4,6 75,6 73,0.4 60.6,0.4 42,19 19.8,19
  pour Bottom (isolate 0.5, no thermals): 18.8,31.4 24.8,31.4 26.2,30 43.8,30 59,45.2 73.2,45.2 75.4,43 79.4,43 79.4,6 75,6 73,0.4 60.6,0.4 42,19 18.8,19
  pour Top (no thermals): 26.2,47.2 29.2,47.2 29.2,42.4 27.2,42.4 26.2,43.4
  pour Route15 (isolate 0.5, no thermals): 19,24.4 15.2,28.2 15.2,47.4 15.6,47.8 28.2,47.8 28,47.6 28,41.4 19.4,41.4 19.4,34.4 22.4,31.4 24.8,31.4 26.6,29.6 26.6,22.4 21.2,22.4 20.4,23.2
  pour Top (no thermals): 17.8,42.6 19,42.6 19,41.4 20.2,40.2 20.2,32.8 24.6,28.4 18.8,28.4 18.8,39.4 17.8,40.4
  pour Bottom (no thermals): 18.8,31.4 18.8,39.4 17.8,40.4 17.8,41.4 19,41.4 19.8,40.6 19.8,31.4
PROG
  Top 0.305: R8.P$2 R7.P$1 32.35,37.55 33.53,37.55 33.58,37.6 U3.3
PWR_LED  (via drill 0.35)
  Top 0.152: U2.25 30.05,15.95 29.76,16.25 29.55,16.25 28.91,16.89 28.91,17.73 28.8,17.83 28.8,19.4 28,20.2 21.8,20.2 18,24 v18,38 | R15.P$2 27.85,41.6 27,41.6 24.2,44.4 24.2,46.4 v24,46.6
  Bottom 0.152: v24,46.6 22.2,46.6 21.4,45.8 21.39,43.17 16.97,43.17 16.6,42.8 16.6,39.4 v18,38
PWR_SW  (via drill 0.35)
  Top 0.152: v36.36,48 35.96,47.6 35.96,45.5 J2.3 | D2.ANODE v48.4,48.8 48.45,48.85 R3.P$2
  Bottom 0.152: v36.36,48 37.76,49.4 47.4,49.4 48,48.8 v48.4,48.8
SNS_PWR_SW  (via drill 0.3, 0.35)
  Top 0.152: U2.10 38.93,14.87 39.57,14.87 40.32,15.62 40.32,15.85 40.48,16 41.8,16 42.4,16.6 v42.4,17.4 | v43.99,19.69 44.4,20.1 44.4,27.4 42.5,29.3 v42.7,29.5 | v43,36 43.17,36.17 46.6,36.17 46.6,46.01 46.96,46.37 48.37,46.37 49,47 49.91,47 49.95,47.05 D6.CATHODE
  Top 0.305: D6.CATHODE 51.15,48.38 R3.P$1 R17.P$1
  Bottom 0.152: v43.99,19.69 42.4,18.1 v42.4,17.4 | v42.7,29.5 42.7,29.9 42,30.6 40.4,30.6 40,31 40,35.2 41,36.2 42.8,36.2 v43,36
SWCLK
  Top 0.152: U2.37 31.75,9.75 31.11,9.11 29.92,9.11 28.58,7.76 20.96,7.76 20.15,6.95 J1.5
SWDIO  (via drill 0.3)
  Top 0.152: U2.36 31.75,10.5 31.7,10.5 30.61,9.41 29.41,9.41 28.4,8.4 v24.4,8.4 | v23.2,7.2 23.2,4.65 J1.3
  Bottom 0.152: v24.4,8.4 v23.2,7.2
TIMER  (via drill 0.3)
  Top 0.152: 32.65,16.88 U2.24 | DB_TIMER.P$1 31.62,19 32.02,18.6
  Top 0.305: U3.4 34.82,37.07 33.47,37.07 C14.P$1 34.41,35.39 v35.99,35.39 v36,35.4 | 32.65,16.88 32.02,17.5 32.02,18.6 32.02,20.38 32.59,20.95 32.59,29.9 34.7,29.9 v35.6,30.8
  Bottom 0.305: v35.6,30.8 36,31.2 v36,35.4
TPS_EN  (via drill 0.35)
  Top 0.152: U2.3 40.65,11.45 40.82,11.63 40.82,12.85 40.95,12.98 41.65,12.98 42.12,13.45 42.12,15.54 v42.19,15.61
  Top 0.254: v41.8,30 41.8,25.2 42.66,24.34 42.66,19.52 43.77,18.4 43.77,16.43 v44.2,16
  Top 0.305: Q4.P$1 43.51,43.47 R16.P$2 43.45,41.86 v40.93,39.34 41.37,38.9 DB_LEN.P$1
  Bottom 0.254: v40.93,39.34 40.93,36.93 39.4,35.4 39.4,30.8 40.2,30 v41.8,30 | v44.2,16 42.6,16 v42.2,15.6 v42.19,15.61
VCC  (via drill 0.3)
  Top 0.254: U6.4 59.87,8.68 C16.P$1 60.25,8.3 v60.25,7.7
  Top 0.305: v32.8,18.65 C7.P$1 33.15,17.6 U2.23 | v34.2,18.65 34.25,18.6 C8.P$1 34.15,18.25 U2.21 | v35.6,18.65 C9.P$1 35.6,18.11 35.1,18.1 35.1,18.01 34.65,17.56 U2.20 | U2.35 30.9,10.95 C11.P$1 | v18.65,2.05 J1.6 | v42.05,12.3 R9.P$2 | v43.94,7.4 R10.P$2 | v45.45,14.1 45.45,15.95 44.2,17.2 44.2,18.6 43.2,19.6 43.2,21 43.55,21.35 R21.P$2
  Top 0.35: 40.4,10.45 U2.1 U2.48
  Top 0.61: C11.P$1 v29.85,10.6 | C6.P$1 40.65,10.7 v40.45,10.5 40.4,10.45 | 8.5,42.75 C25.P$1 | R28.P$1 17,19.4 v17.05,19.45 | R27.P$1 21.2,18.63 v21.19,18.06 v21.18,18.05
  Top 1: L2.1 9.29,42.75 8.5,42.75
  Route2 0.254: v60.25,7.7 60.05,7.5 47.5,7.5 v45.8,9.2
  other vias: 27,14.2 27.8,14.2 40.8,1.9 7.4,43.4 7.4,42.6 7.4,41.8 8.2,41.4 40,1.9 40,1.1 40.8,1.1
  pour Top (no thermals): 26.6,14.6 28.2,14.6 28.2,12.8 26.6,12.8
  pour Route15 (isolate 0.2, rank 3, no thermals): 0.6,47.6 2.4,49.4 46.6,49.4 46.6,0.6 2.2,0.6 0.6,2.2
  pour Top (no thermals): 7,45.4 8.8,45.4 8.8,41 7,41
  pour Top (no thermals): 32.4,18.8 35.8,18.8 35.8,18 34.8,18 34.4,17.6 32.8,17.6 32.4,18
  pour Top (no thermals): 39.6,5.6 41.2,5.6 41.2,0.4 39.6,0.4
VIN_SAMP  (via drill 0.35)
  Top 0.152: C18.P$1 30.85,14.95 U2.27 | R12.P$2 29.9,23.25 R11.P$1
  Top 0.254: 30.06,23.09 R12.P$2
  Top 0.305: v29.43,15.2 29.45,15.17 30.4,15.17 30.57,15 C18.P$1 | v29.6,17.8 29.6,22.64 30.06,23.09
  Bottom 0.305: v29.43,15.2 29.43,17.63 v29.6,17.8
VREF
  Top 0.305: R7.P$2 33.3,38.1 U3.2
VSENSE  (via drill 0.5)
  Top 0.152: 51.95,40 Q3.2
  other vias: 41.4,34.6 41.4,33.2 41.4,31.8 42.8,33.2 42.8,34.6 44.2,34.6 44.2,33.2 44.2,31.8 47.8,33.6 48.8,33.6 49.8,33.6 50.8,33.6 51.8,33.6 52.8,33.6 53.8,33.6 47.8,20.8 48.8,20.8 49.8,20.8 50.8,20.8 51.8,20.8 52.8,20.8 53.8,20.8 45.6,34.6 46.8,34.6 48,8.4 49,8.4 50,8.4 51,8.4 52,8.4 53,8.4 54,8.4 55,8.4 54.8,20.8 55.8,20.8 54.8,33.6 55.8,33.6 42.8,31.8 45.6,33.2
  pour Top (isolate 0.5, no thermals): 40.4,30.8 40.4,35.2 40.8,35.6 47.4,35.6 47.4,45.6 56.4,45.6 56.4,7.8 47.2,7.8 47.2,25.8 42.2,30.8
  pour Route2 (isolate 0.5, no thermals): 40.8,35.6 47.4,35.6 47.4,45.6 55.8,45.6 55.8,8 47.2,8 47.2,25.8 42.2,30.8 40.4,30.8 40.4,35.2
VSENSE_HIGH
  Top 0.305: U5.7 36.48,28.07 36.7,28.3 36.7,32.5 R4.3 36.8,34 36.8,37.7 37.7,38.6 U3.10
VSENSE_LOW
  Top 0.305: U5.2 37.92,28.07 37.3,28.7 37.3,32.5 R4.4 37.3,33.9 37.3,37.4 38,38.1 U3.9
VSW
  pour Top (rank 2, no thermals): 14.4,47.2 16.8,47.2 17.6,46.4 17.6,45.8 17.85,45.55 18.59,45.55 18.59,45.21 17.01,45.21 17,45.2 15.6,45.2 14.4,46.4
VSWITCHED  (via drill 0.3, 0.5)
  Top 0.305: 59,33.6 58.6,34 58.6,35 v58,35.6 | v42.11,36.9 41.91,37.1 41.9,37.1 U3.7 | R13.P$2 61.75,5.95 v63.8,8
  Top 0.406: DB_VSW.P$1 66.4,44.4 v64.2,44.4
  Bottom 0.305: v58,35.6 57.45,36.15 45.05,36.15 44.2,36.9 v42.11,36.9
  other vias: 59,20.8 60.2,20.8 61.4,20.8 62.6,20.8 63.8,20.8 61.4,33.6 62.6,33.6 63.8,33.6 64.2,15.2 62.2,15.2 61.2,15.2 64.2,18.8 62.2,18.8 61.2,18.8 62.2,40.8 64.2,40.8 61.2,31.6 62.2,31.6 64.2,31.6 61.1,28 62.2,28 64.2,28 62.2,44.4 61.2,44.4 61.2,40.8 63.2,18.8 63.2,15.2 63.2,31.6 63.2,28 63.2,44.4 63.2,40.8 60.2,18.8 60.2,15.2 60.2,31.6 60.1,28 60.2,44.4 60.2,40.8
  pour Top (isolate 0.5, no thermals): 58.4,45.2 73.2,45.2 75.4,43 79.4,43 79.4,6 73.6,6 72.8,5.2 65.2,5.2 58.4,12
  pour Route2 (isolate 0.5, no thermals): 58.4,45.2 73.2,45.2 75.4,43 79.4,43 79.4,6 73.6,6 72.8,5.2 65.2,5.2 58.4,12
VSWITCHED_SAMP
  Top 0.254: R14.P$2 44.18,12.72 44.19,14.73 43.03,14.73 43.03,17.69 43.01,17.71 41.95,18.94 38.74,18.94 37.75,17.95 C19.P$1
  Top 0.305: C19.P$1 37.15,17.8 U2.15 | R13.P$1 59.3,6.2 47.4,6.2 45,8.6 45,9.6 45.6,10.2 45.6,12.4 44.6,12.4 R14.P$2

### Text on the board
tPlace: VIN | VSW | L+ | L- | W | G | G | 3V | 5V | G | 1 | 2 | 3 | 3V | power dist r4.5b | (c) 2023
tNames: EN | IS | TEMP | FLT | TIM